# EasyEDA Pro project NeuraCore-Final.epro, board PCB1
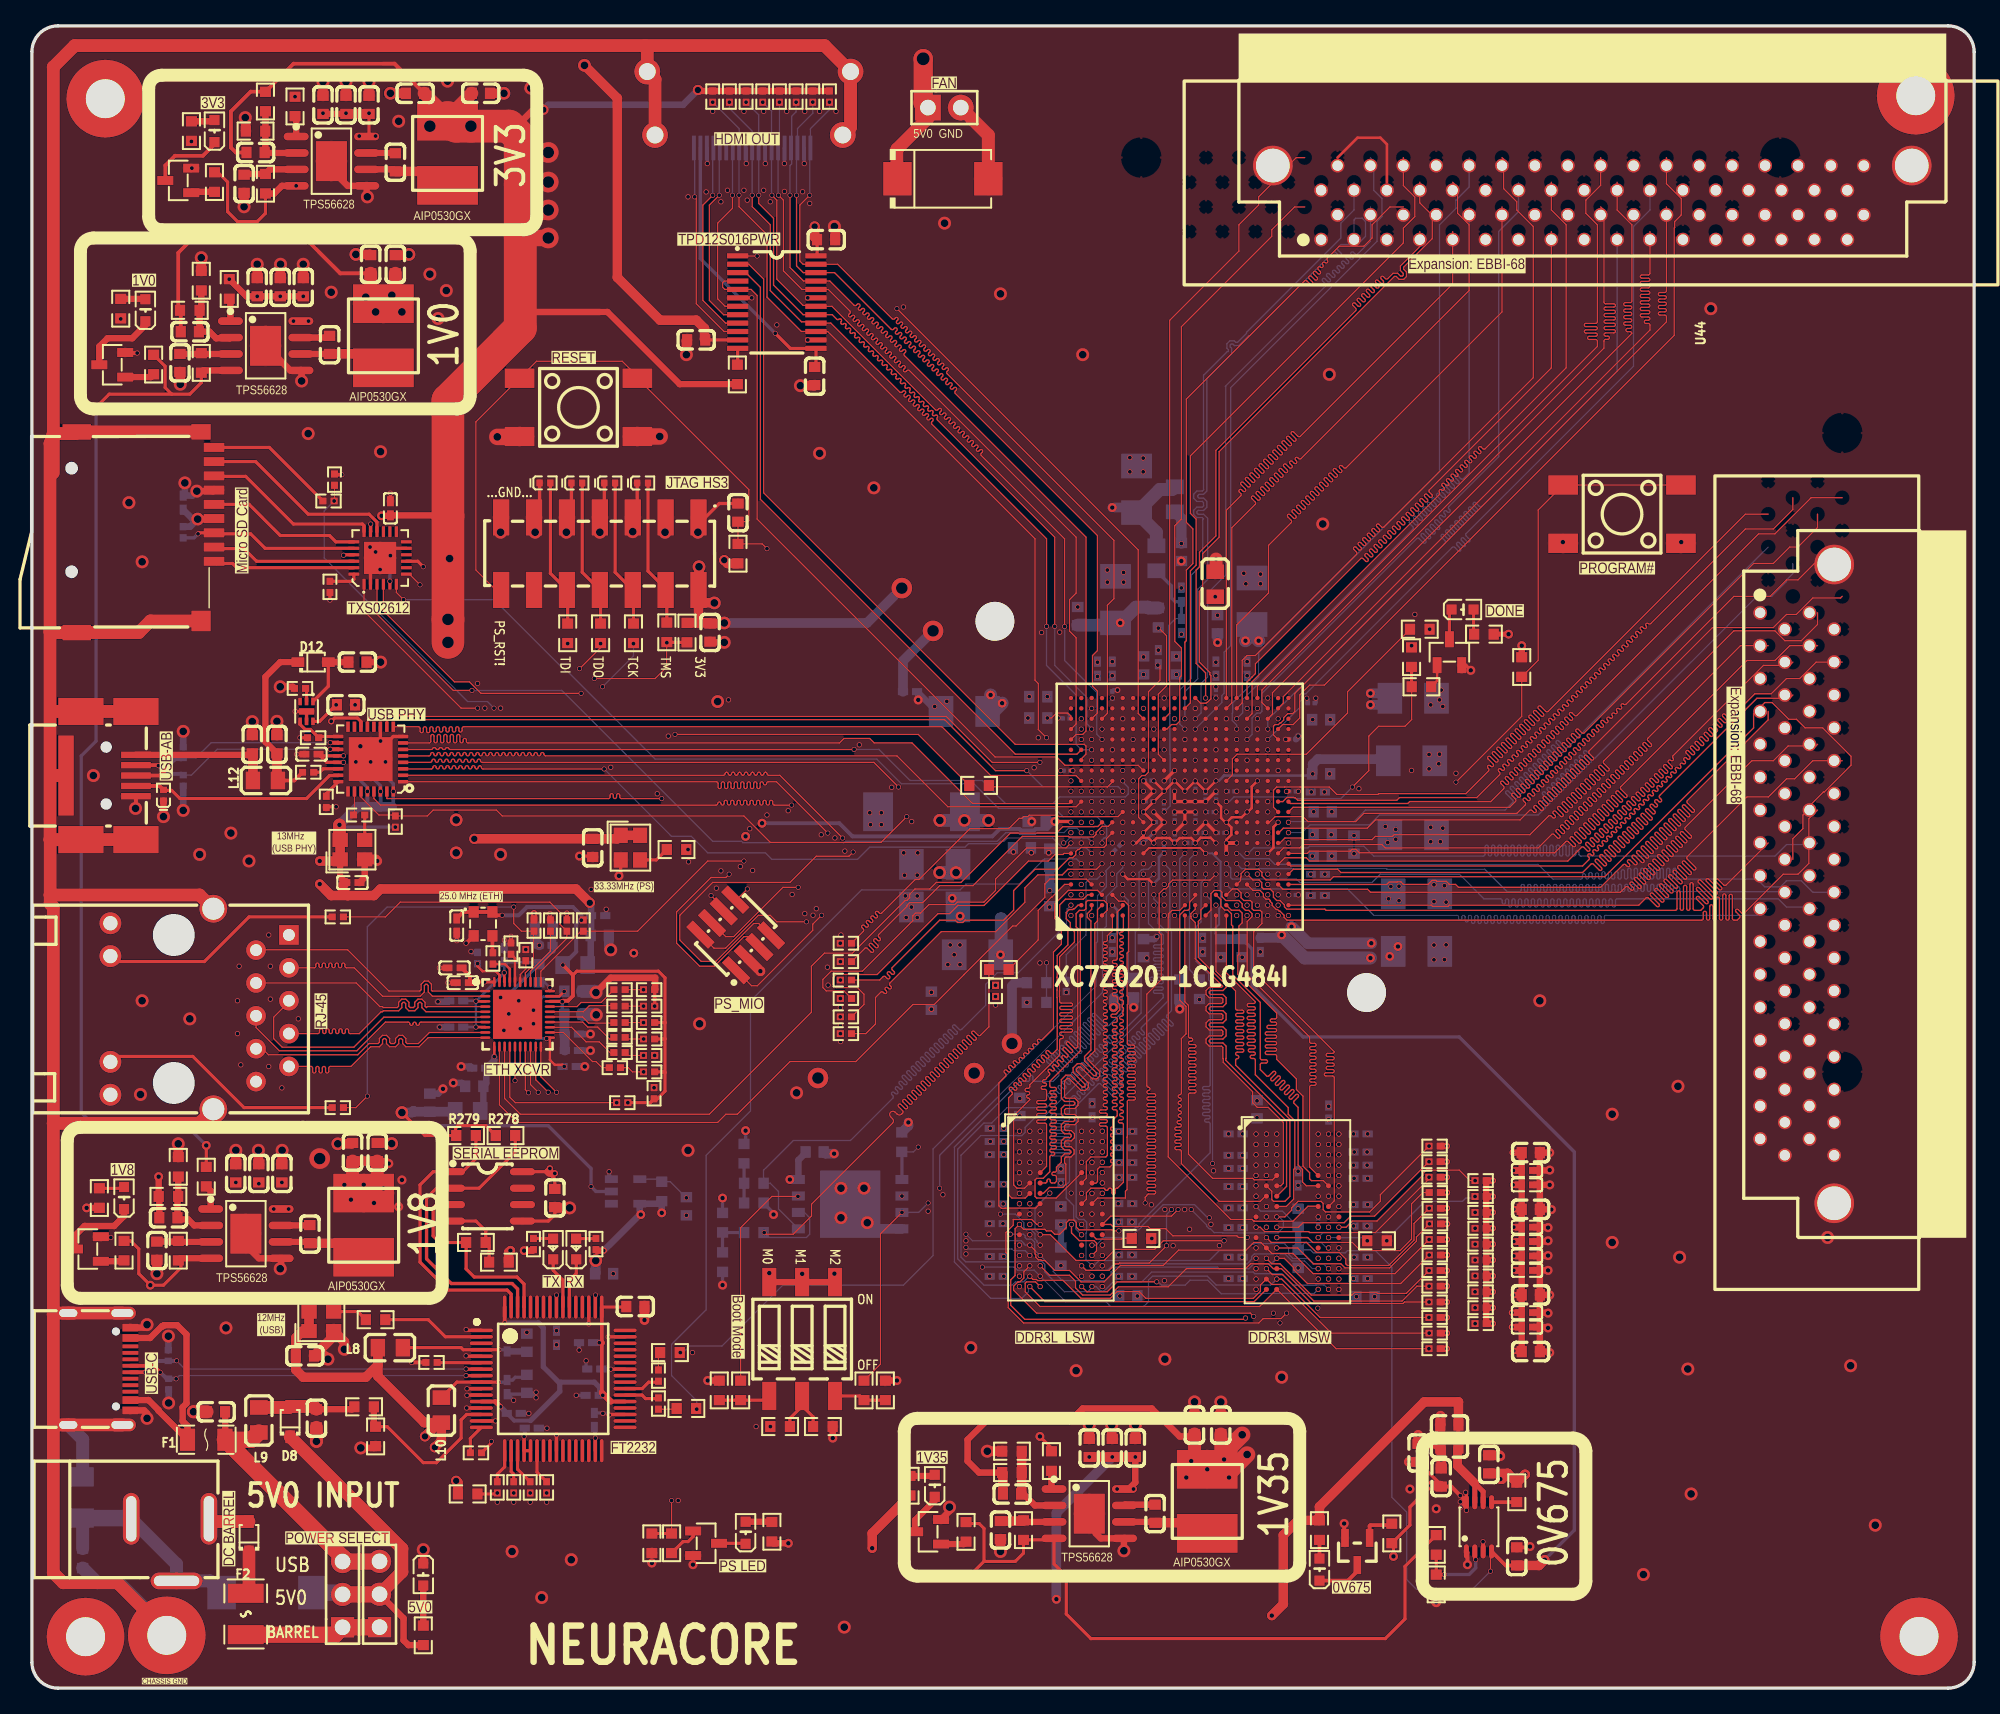
[diagram p13: board, top side]
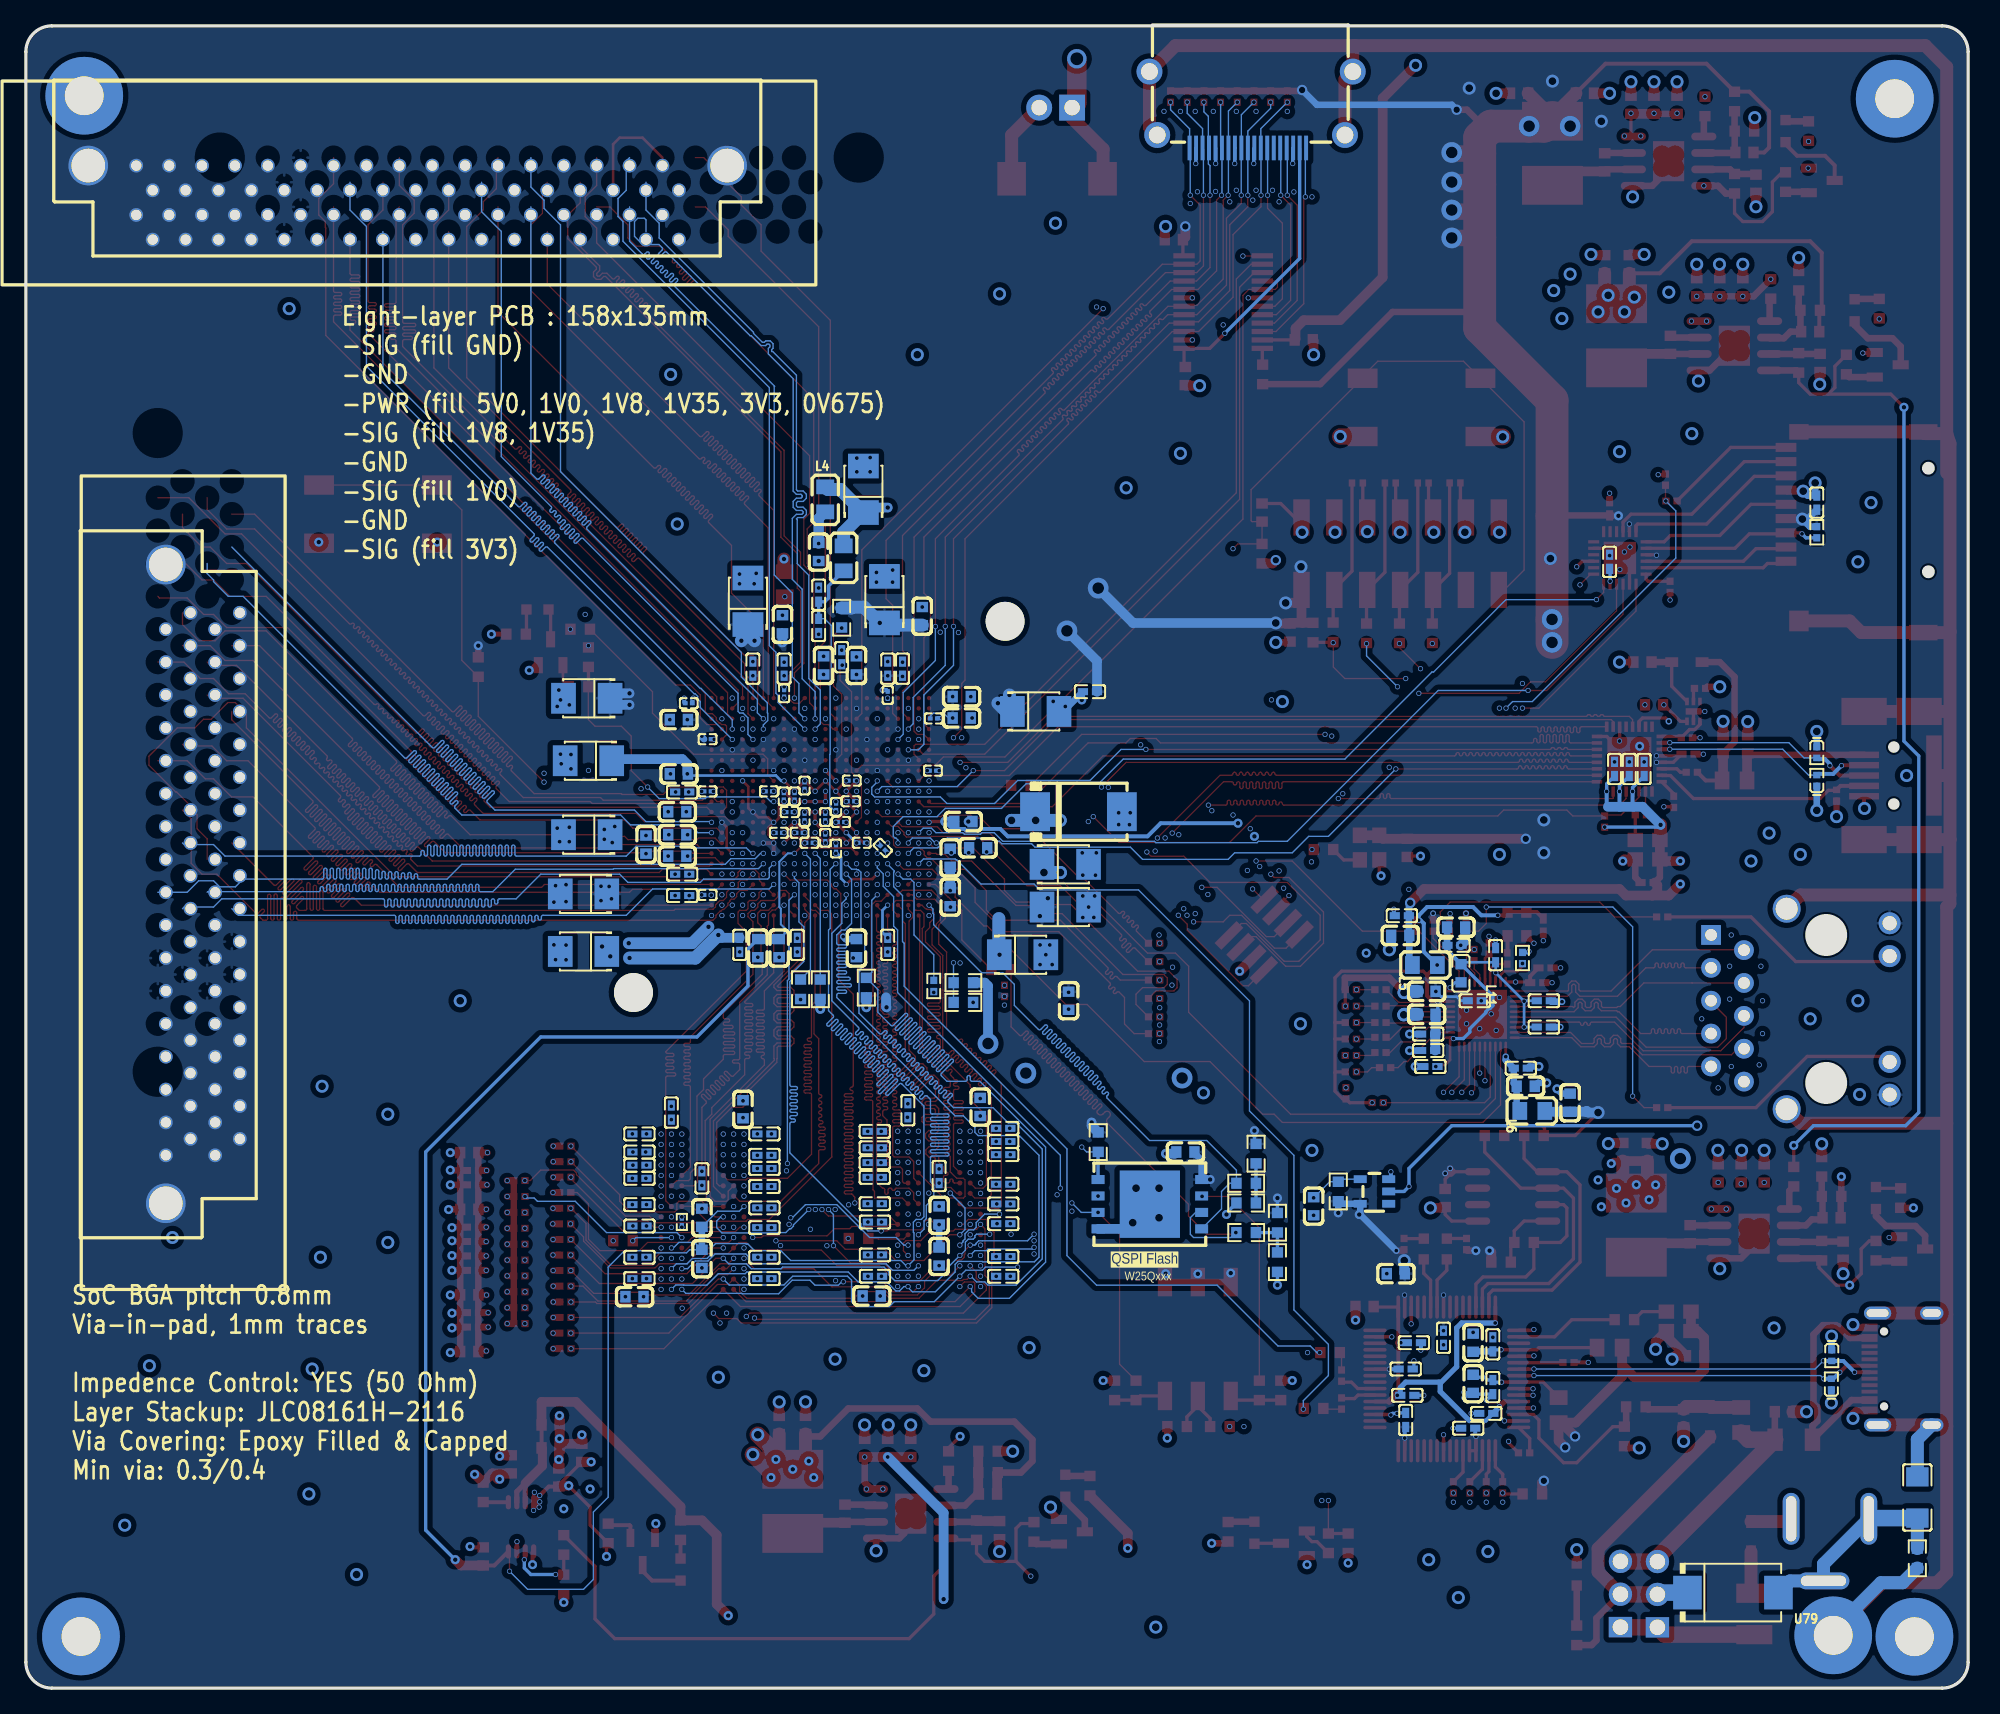
[diagram p14: board, bottom side, seen from below]

Outline 150 x 128.41 mm; copper layers: Top Layer, GND2, PWR3, SIGNAL4, GND5, SIGNAL6, GND7, Bottom Layer. Coordinates in mm from the lower left corner of the outline.
Outline path: 0,126.41 0,2 arc(0.59,0.59) 2,0 148,0 arc(149.41,0.59) 150,2 150,126.41 arc(149.41,127.82) 148,128.41 2,128.41 arc(0.59,127.82) 0,126.41
Stack: Top Layer 0.035mm 外层铜厚1oz / Dielectric1 0.1164mm 2116 RC54% 4.9mil / GND2 0.035mm - / Dielectric2 0.3mm 0.3mm H/HOZ 不含铜 / PWR3 0.035mm - / Dielectric3 0.0764mm 1080 RC67% 3.3mil / SIGNAL4 0.035mm - / Dielectric4 0.0764mm 1080 RC67% 3.3mil / GND5 0.035mm - / Dielectric5 0.3mm 0.3mm H/HOZ 不含铜 / SIGNAL6 0.035mm - / Dielectric6 0.0764mm 1080 RC67% 3.3mil / GND7 0.035mm - / Dielectric7 0.0764mm 1080 RC67% 3.3mil / Bottom Layer 0.035mm 外层铜厚1oz

## Design rules (mm)
net DP1: USB_D
net DN1: USB_D
net DDR_DQS1_P: DDR_DQS1
net DDR_DQS1_N: DDR_DQS1
net DDR_DQS0_N: DDR_DQS0
net DDR_DQS0_P: DDR_DQS0
net DDR_CK_P: DDR_CK
net DDR_CK_N: DDR_CK
net DDR_DQS2_P: DDR_DQS2
net DDR_DQS2_N: DDR_DQS2
net DDR_DQS3_N: DDR_DQS3
net DDR_DQS3_P: DDR_DQS3
net MDI0_P: MDI0
net MDI0_N: MDI0
net MDI1_P: MDI1
net MDI1_N: MDI1
net MDI2_P: MDI2
net MDI2_N: MDI2
net MDI3_P: MDI3
net MDI3_N: MDI3
net HDMI_TX_D2_P: HDMI_TX_D2
net HDMI_TX_D0_P: HDMI_TX_D0
net HDMI_TX_D2_N: HDMI_TX_D2
net HDMI_TX_D0_N: HDMI_TX_D0
net HDMI_TX_CLK_N: HDMI_TX_CLK
net HDMI_TX_CLK_P: HDMI_TX_CLK
net HDMI_TX_D1_N: HDMI_TX_D1
net HDMI_TX_D1_P: HDMI_TX_D1
net HDMI_RX_D0_N: HDMI_RX_D0
net HDMI_RX_D0_P: HDMI_RX_D0
net HDMI_RX_D2_N: HDMI_RX_D2
net HDMI_RX_D2_P: HDMI_RX_D2
net HDMI_RX_D1_N: HDMI_RX_D1
net HDMI_RX_D1_P: HDMI_RX_D1
net HDMI_RX_CLK_N: HDMI_RX_CLK
net HDMI_RX_CLK_P: HDMI_RX_CLK
net OTG_DN: OTG_DP
net OTG_DP: OTG_DP
template: Custom Config
spacing copperThickness1oz (default): track to track 0.089, other pairs 0.089 to 0.3
spacing copperThickness2oz: track to track 0.203, other pairs 0.152 to 0.3
spacing copperThicknessInner0.5oz: track to track 0.089, other pairs 0.152 to 0.3
track width copperThickness1oz (default): min 0.08, default 0.09, max 2.54
track width copperThickness2oz: min 0.203, default 0.254, max 2.54
track width copperThickness0.5oz: min 0.089, default 0.254, max 2.54
differential pair differentialPair (default): width min 0.099, default 0.254, max 2.54; gap min 0.099, default 0.152
via viaSize (default): diameter min 0.4, default 0.61, max 10; hole min 0.3, default 0.305, max 6.3
net QSPI_DQ1_M1 uses QSPI
net QSPI_DQ2_M2 uses QSPI
net QSPI_DQ0_M3 uses QSPI
net QSPI_CSB uses QSPI
net QSPI_CLK uses QSPI
net QSPI_DQ3_M0 uses QSPI
net DDR_ODT uses DDR_ACC
net DDR_DQ13 uses DDR_BL1
net DDR_DQ11 uses DDR_BL1
net DDR_DQ2 uses DDR_BL0
net DDR_DQ6 uses DDR_BL0
net DDR_CSB uses DDR_ACC
net DDR_BA0 uses DDR_ACC
net DDR_ADDR3 uses DDR_ACC
net DDR_ADDR5 uses DDR_ACC
net DDR_ADDR7 uses DDR_ACC
net DDR_RSTB uses DDR_ACC
net DDR_DQ15 uses DDR_BL1
net DDR_DQ9 uses DDR_BL1
net DDR_DM0 uses DDR_BL0
net DDR_DQ0 uses DDR_BL0
net DDR_DQS1_P uses DDR_BL1
net DDR_DQS1_N uses DDR_BL1
net DDR_DQ4 uses DDR_BL0
net DDR_RASB uses DDR_ACC
net DDR_CASB uses DDR_ACC
net DDR_WEB uses DDR_ACC
net DDR_BA1 uses DDR_ACC
net DDR_ADDR0 uses DDR_ACC
net DDR_ADDR2 uses DDR_ACC
net DDR_ADDR9 uses DDR_ACC
net DDR_ADDR13 uses DDR_ACC
net DDR_DQ12 uses DDR_BL1
net DDR_DQS0_N uses DDR_BL0
net DDR_DQS0_P uses DDR_BL0
net DDR_DQ8 uses DDR_BL1
net DDR_DM1 uses DDR_BL1
net DDR_DQ1 uses DDR_BL0
net DDR_DQ7 uses DDR_BL0
net DDR_CK_P uses DDR_ACC
net DDR_CK_N uses DDR_ACC
net DDR_ADDR10 uses DDR_ACC
net DDR_ADDR12 uses DDR_ACC
net DDR_ADDR1 uses DDR_ACC
net DDR_ADDR11 uses DDR_ACC
net DDR_ADDR14 uses DDR_ACC
net DDR_DQ14 uses DDR_BL1
net DDR_DQ10 uses DDR_BL1
net DDR_DQ3 uses DDR_BL0
net DDR_DQ5 uses DDR_BL0
net DDR_ADDR4 uses DDR_ACC
net DDR_ADDR6 uses DDR_ACC
net DDR_ADDR8 uses DDR_ACC
net DDR_CKE uses DDR_ACC
net DDR_DQ29 uses DDR_BL3
net DDR_DQ27 uses DDR_BL3
net DDR_DQ18 uses DDR_BL2
net DDR_DQ22 uses DDR_BL2
net DDR_DQ31 uses DDR_BL3
net DDR_DQ25 uses DDR_BL3
net DDR_DM3 uses DDR_BL3
net DDR_DQ16 uses DDR_BL2
net DDR_DQS2_P uses DDR_BL2
net DDR_DQS2_N uses DDR_BL2
net DDR_DQ20 uses DDR_BL2
net DDR_DQ28 uses DDR_BL3
net DDR_DQS3_N uses DDR_BL3
net DDR_DQS3_P uses DDR_BL3
net DDR_DQ24 uses DDR_BL3
net DDR_DM2 uses DDR_BL2
net DDR_DQ17 uses DDR_BL2
net DDR_DQ23 uses DDR_BL2
net DDR_DQ30 uses DDR_BL3
net DDR_DQ26 uses DDR_BL3
net DDR_DQ19 uses DDR_BL2
net DDR_DQ21 uses DDR_BL2
net DDR_BA2 uses DDR_ACC
net ETH_PHY_TXCLK uses ETH_PHY_TX
net ETH_PHY_TXCTL uses ETH_PHY_TX
net ETH_PHY_TXD0 uses ETH_PHY_TX
net ETH_PHY_TXD1 uses ETH_PHY_TX
net ETH_PHY_TXD2 uses ETH_PHY_TX
net ETH_PHY_TXD3 uses ETH_PHY_TX
net ETH_RXD2 uses ETH_RX
net ETH_TXCTL uses ETH_TX
net ETH_RXD0 uses ETH_RX
net ETH_TXD2 uses ETH_TX
net ETH_TXD0 uses ETH_TX
net ETH_RXCTL uses ETH_RX
net ETH_TXCLK uses ETH_TX
net ETH_RXD1 uses ETH_RX
net ETH_RXCLK uses ETH_RX
net ETH_RXD3 uses ETH_RX
net ETH_TXD3 uses ETH_TX
net ETH_TXD1 uses ETH_TX
net MDI0_P uses MDI
net MDI0_N uses MDI
net MDI1_P uses MDI
net MDI1_N uses MDI
net MDI2_P uses MDI
net MDI2_N uses MDI
net MDI3_P uses MDI
net MDI3_N uses MDI
net USB_DIR uses USB_DATA
net USB_STP uses USB_DATA
net USB_DATA7 uses USB_DATA
net USB_DATA6 uses USB_DATA
net USB_DATA5 uses USB_DATA
net USB_DATA4 uses USB_DATA
net USB_DATA3 uses USB_DATA
net USB_DATA2 uses USB_DATA
net USB_DATA1 uses USB_DATA
net USB_DATA0 uses USB_DATA
net USB_NXT uses USB_DATA
net USB_CLK uses USB_DATA
net HDMI_TX_D2_P uses HDMI_TX
net HDMI_TX_D0_P uses HDMI_TX
net HDMI_TX_D2_N uses HDMI_TX
net HDMI_TX_D0_N uses HDMI_TX
net HDMI_TX_CLK_N uses HDMI_TX
net HDMI_TX_CLK_P uses HDMI_TX
net HDMI_TX_D1_N uses HDMI_TX
net HDMI_TX_D1_P uses HDMI_TX
net IO_L12N_T1_SRCC_13 uses IOL_RIGHT
net IO_L7N_T1_13 uses IOL_RIGHT
net IO_L8N_T1_13 uses IOL_RIGHT
net IO_L9P_T1_DQS_13 uses IOL_RIGHT
net IO_L9N_T1_DQS_13 uses IOL_RIGHT
net IO_L7P_T1_13 uses IOL_RIGHT
net IO_L8P_T1_13 uses IOL_RIGHT
net IO_L11P_T1_SRCC_13 uses IOL_RIGHT
net IO_L11N_T1_SRCC_13 uses IOL_RIGHT
net IO_L10P_T1_13 uses IOL_RIGHT
net IO_L10N_T1_13 uses IOL_RIGHT
net IO_L12P_T1_SRCC_13 uses IOL_RIGHT
net IO_L14P_T2_SRCC_13 uses IOL_RIGHT
net IO_L14N_T2_SRCC_13 uses IOL_RIGHT
net IO_L16P_T2_13 uses IOL_RIGHT
net IO_L16N_T2_13 uses IOL_RIGHT
net IO_L18N_T2_13 uses IOL_RIGHT
net IO_L15N_T2_DQS_13 uses IOL_RIGHT
net IO_L17P_T2_13 uses IOL_RIGHT
net IO_L17N_T2_13 uses IOL_RIGHT
net IO_L13P_T2_MRCC_13 uses IOL_RIGHT
net IO_L13N_T2_MRCC_13 uses IOL_RIGHT
net IO_L15P_T2_DQS_13 uses IOL_RIGHT
net IO_L18P_T2_13 uses IOL_RIGHT
net IO_L19N_T3_VREF_13 uses IOL_RIGHT
net IO_25_13 uses IOL_RIGHT
net IO_L22N_T3_13 uses IOL_RIGHT
net IO_L23P_T3_13 uses IOL_RIGHT
net IO_L21N_T3_DQS_13 uses IOL_RIGHT
net IO_L24P_T3_13 uses IOL_RIGHT
net IO_L19P_T3_13 uses IOL_RIGHT
net IO_L20P_T3_13 uses IOL_RIGHT
net IO_L22P_T3_13 uses IOL_RIGHT
net IO_L20N_T3_13 uses IOL_RIGHT
net IO_L21P_T3_DQS_13 uses IOL_RIGHT
net IO_L23N_T3_13 uses IOL_RIGHT
net IO_L24N_T3_13 uses IOL_RIGHT
net IO_L2P_T0_33 uses IOL_TOP
net IO_L5P_T0_33 uses IOL_TOP
net IO_L2N_T0_33 uses IOL_TOP
net IO_L6N_T0_VREF_33 uses IOL_TOP
net IO_L3P_T0_DQS_33 uses IOL_TOP
net IO_L4N_T0_33 uses IOL_TOP
net IO_L1P_T0_33 uses IOL_TOP
net IO_L1N_T0_33 uses IOL_TOP
net IO_L6P_T0_33 uses IOL_TOP
net IO_L5N_T0_33 uses IOL_TOP
net IO_L4P_T0_33 uses IOL_TOP
net IO_L3N_T0_DQS_33 uses IOL_TOP
net HDMI_RX_D0_N uses HDMI_RX
net HDMI_RX_D0_P uses HDMI_RX
net HDMI_RX_D2_N uses HDMI_RX
net HDMI_RX_D2_P uses HDMI_RX
net HDMI_RX_D1_N uses HDMI_RX
net HDMI_RX_D1_P uses HDMI_RX
net HDMI_RX_CLK_N uses HDMI_RX
net HDMI_RX_CLK_P uses HDMI_RX
net IO_L9N_T1_33 uses IOL_TOP
net IO_L11P_T1_SRCC_33 uses IOL_TOP
net IO_L8P_T1_33 uses IOL_TOP
net IO_L12N_T1_MRCC_33 uses IOL_TOP
net IO_L9P_T1_33 uses IOL_TOP
net IO_L12P_T1_MRCC_33 uses IOL_TOP
net IO_L11N_T1_SRCC_33 uses IOL_TOP
net ETH_PHY_RXD3 uses ETH_PHY_RX
net ETH_PHY_RXD2 uses ETH_PHY_RX
net ETH_PHY_RXD1 uses ETH_PHY_RX
net ETH_PHY_RXD0 uses ETH_PHY_RX
net ETH_PHY_RXCTL uses ETH_PHY_RX
net ETH_PHY_RXCLK uses ETH_PHY_RX
eq len grp QSPI uses QSPI
eq len grp DDR_ACC uses DDR_ACC
eq len grp DDR_BL1 uses DDR_BL1
eq len grp DDR_BL0 uses DDR_BL0
eq len grp DDR_BL3 uses DDR_BL3
eq len grp DDR_BL2 uses DDR_BL2
eq len grp ETH_PHY_TX uses ETH_PHY_TX
eq len grp ETH_RX uses ETH_RX
eq len grp ETH_TX uses ETH_TX
eq len grp MDI uses MDI
eq len grp USB_DATA uses USB_DATA
eq len grp HDMI_TX uses HDMI_TX
eq len grp IOL_RIGHT uses IOL_RIGHT
eq len grp IOL_TOP uses IOL_TOP
eq len grp HDMI_RX uses HDMI_RX
eq len grp ETH_PHY_RX uses ETH_PHY_RX
pour e16650 uses copperRegionSafer
pour e17316 uses copperRegionSafer
pour e10447 uses copperRegionSafer
pour e18637 uses copperRegionSafer
pour e22974 uses copperRegion

## Placement (name value [footprint] x y rotation side)
C1  10uF  [C0603]  22.48 122.31 90 top
C2  10uF  [C0603]  24.26 122.31 90 top
C3  0.1uF  [C0603]  26.03 122.31 90 top
C4  10pF  [C0603]  17.27 118.63 180 top
C5  10pF  [C0603]  16.38 116.22 270 top
C6  47nF  [C0603]  79.47 36.51 270 bottom
C7  0.1uF  [C0603]  28.07 117.87 270 top
C8  22uF  [C0603]  34.67 123.2 0 top
C9  22uF  [C0603]  29.59 123.2 180 top
C10  10uF  [C0603]  15.75 39.76 90 top
C11  10uF  [C0603]  17.53 39.76 90 top
C12  0.1uF  [C0603]  19.3 39.76 90 top
C13  10pF  [C0603]  10.54 36.34 180 top
C14  10pF  [C0603]  9.65 33.8 270 top
C15  0.1uF  [C0603]  21.46 35.06 270 top
C16  22uF  [C0603]  26.67 41.42 90 top
C17  22uF  [C0603]  24.77 41.42 90 top
C18  10uF  [C0603]  81.66 18.56 90 top
C19  10uF  [C0603]  83.44 18.56 90 top
C20  0.1uF  [C0603]  85.22 18.56 90 top
C21  47pF  [C0603]  75.69 15 180 top
C22  10pF  [C0603]  74.8 12.21 270 top
C23  0.1uF  [C0603]  86.74 13.48 270 top
C24  22uF  [C0603]  89.79 20.33 90 top
C25  22uF  [C0603]  91.82 20.33 90 top
C26  10uF  [C0603]  17.4 108.22 90 top
C27  10uF  [C0603]  19.18 108.22 90 top
C28  0.1uF  [C0603]  20.95 108.22 90 top
C29  150pF  [C0603]  12.19 104.79 180 top
C30  10pF  [C0603]  11.43 102.38 270 top
C31  0.1uF  [C0603]  22.99 103.77 270 top
C32  22uF  [C0603]  28.07 110 90 top
C33  22uF  [C0603]  26.16 110 90 top
C34  4.7uF  [C0603]  38.23 23.51 270 bottom
C35  47nF  [C0603]  97.79 36.34 270 bottom
C36  47nF  [C0603]  79.47 33.34 270 bottom
C37  47nF  [C0603]  97.79 33.16 270 bottom
C38  47nF  [C0603]  91.82 57.16 270 bottom
C39  47nF  [C0603]  93.47 57.16 270 bottom
C40  47nF  [C0402]  115.47 39.99 0 top
C41  47nF  [C0402]  115.47 27.89 0 top
C42  4.7uF  [C0603]  78.61 61.1 270 bottom
C43  47nF  [C0402]  115.47 35.61 0 top
C44  47nF  [C0402]  115.47 32.27 0 top
C45  4.7uF  [C0603]  77.72 74.94 180 bottom
C46  4.7uF  [C0603]  103 30.24 0 bottom
C47  470nF  [C0402]  102.62 31.64 0 bottom
C48  47nF  [C0402]  102.62 37.35 0 bottom
C49  4.7uF  [C0603]  77.72 76.59 180 bottom
C50  47nF  [C0402]  92.96 37.1 180 bottom
C51  47nF  [C0402]  92.96 35.57 180 bottom
C52  4.7uF  [C0603]  78.61 64.15 90 bottom
C53  47nF  [C0402]  92.96 40.15 180 bottom
C54  47nF  [C0402]  92.96 42.81 180 bottom
C55  4.7uF  [C0603]  80.77 82.82 90 bottom
C56  47nF  [C0402]  92.96 33.29 180 bottom
C57  47nF  [C0402]  102.62 33.29 0 bottom
C58  4.7uF  [C0603]  91.57 82.18 90 bottom
C59  47nF  [C0402]  102.62 40.4 0 bottom
C60  4.7uF  [C0603]  94.62 44.72 90 bottom
C61  470nF  [C0402]  100.15 44.46 90 bottom
C62  4.7uF  [C0603]  99.57 74.82 0 bottom
C63  47nF  [C0402]  92.96 31.64 180 bottom
C64  47nF  [C0402]  102.62 35.7 0 bottom
C65  4.7uF  [C0603]  85.85 79.01 90 bottom
C66  47nF  [C0402]  102.62 39.38 0 bottom
C67  47nF  [C0402]  102.62 41.42 0 bottom
C68  47nF  [C0402]  92.96 41.16 180 bottom
C69  47nF  [C0402]  92.96 38.75 180 bottom
C70  47nF  [C0402]  102.62 42.81 0 bottom
C71  47nF  [C0402]  97.79 39.38 90 bottom
C72  470nF  [C0402]  115.47 34.5 0 top
C73  4.7uF  [C0603]  76.45 64.91 180 bottom
C74  470nF  [C0402]  115.47 29 0 top
C75  470nF  [C0402]  115.47 33.38 0 top
C76  470nF  [C0402]  115.47 38.88 0 top
C77  4.7uF  [C0603]  84.68 30.29 0 bottom
C78  4.7uF  [C0603]  99.69 67.7 0 bottom
C79  470nF  [C0402]  81.88 44.64 90 bottom
C80  47nF  [C0402]  84.44 41.74 0 bottom
C81  47nF  [C0402]  84.44 40.6 0 bottom
C82  47nF  [C0402]  74.52 31.81 180 bottom
C83  4.7uF  [C0603]  88.39 79.01 90 bottom
C84  47nF  [C0402]  84.42 36.01 0 bottom
C85  4.7uF  [C0603]  99.69 65.93 0 bottom
C86  47nF  [C0402]  84.44 37.42 0 bottom
C87  47nF  [C0402]  84.44 43.01 0 bottom
C88  47nF  [C0402]  74.52 37.4 180 bottom
C89  47nF  [C0402]  84.44 39.45 0 bottom
C90  4.7uF  [C0603]  115.76 26 0 top
C91  4.7uF  [C0603]  115.76 30.38 0 top
C92  4.7uF  [C0603]  115.76 36.99 0 top
C93  4.7uF  [C0603]  115.76 41.37 0 top
C94  4.7uF  [C0603]  76.29 44.9 90 bottom
C95  470nF  [C0402]  84.42 31.81 0 bottom
C96  47nF  [C0402]  74.52 41.21 180 bottom
C97  47nF  [C0402]  74.52 38.93 180 bottom
C98  47nF  [C0402]  74.52 33.34 180 bottom
C99  47nF  [C0402]  74.52 42.23 180 bottom
C100  47nF  [C0402]  74.52 35.88 180 bottom
C101  47nF  [C0402]  74.52 43.24 180 bottom
C102  47nF  [C0402]  84.42 33.47 0 bottom
C103  47nF  [C0402]  79.47 39.56 90 bottom
C144  100nF  [C0603]  60.45 41.42 0 bottom
C155  4u7  [C0603]  41.83 52.05 0 bottom
C157  4u7  [C0603]  43.86 58.15 0 bottom
C159  4u7  [C0603]  41.83 53.83 0 bottom
C166  4u7  [C0603]  34.16 46.5 180 bottom
C168  4u7  [C0603]  30.73 45.23 90 bottom
C170  4u7  [C0603]  39.54 58.78 180 bottom
C176  100nF  [C0603]  52.37 81.54 270 top
C181  4.7uF  [C0603]  14.22 21.35 180 top
C182  4.7uF  [C0603]  21.97 20.84 270 top
C183  100nF  [C0603]  44.2 32.02 0 bottom
C184  4.7uF  [C0603]  46.61 29.48 0 top
C189  4.7uF  [C0603]  38.23 26.68 90 bottom
C190  100nF  [C0603]  40.39 37.86 270 top
C191  100nF  [C0603]  21.08 25.67 0 top
C192  100nF  [C0603]  43.31 64.91 270 top
C193  100nF  [C0603]  69.47 53.1 270 bottom
C194  100nF  [C0603]  50.55 37.22 270 bottom
C195  100nF  [C0603]  54.53 90.81 90 top
C217  22uF  [C0603]  109.47 20.33 180 top
C218  4.7uF  [C0603]  112.52 17.28 90 top
C219  4.7uF  [C0603]  109.47 18.56 180 top
C220  22uF  [C0603]  108.84 16.27 90 top
C221  4.7uF  [C0603]  107.06 18.17 90 top
C222  4.7uF  [C0603]  114.68 10.17 90 top
C227  4.7uF  [C0603]  18.92 72.91 90 top
C228  4.7uF  [C0603]  17.02 72.91 90 top
C229  4.7uF  [C0603]  24.26 75.96 0 top
C230  4.7uF  [C0603]  25.15 79.26 0 top
C240  100nF  [C0603]  51.31 104.15 0 top
C241  100nF  [C0603]  61.34 111.9 180 top
C243  100nF  [C0603]  60.45 101.36 90 top
C244  4.7uF  [C0603]  99.57 70.63 0 bottom
C248  330uF  [CAP-SMD_L7.3-W4.3-L-FD]  68.71 67.7 180 bottom
C253  100uF  [CAP-SMD_L3.5-W2.8-FD]  106.55 71.64 0 bottom
C257  100uF  [CAP-SMD_L3.5-W2.8-FD]  94.23 83.96 90 bottom
C258  100uF  [CAP-SMD_L3.5-W2.8-FD]  85.32 92.61 90 bottom
C259  470nF  [C0402]  93.85 78.75 90 bottom
C261  47uF  [CAP-SMD_L3.5-W2.8-FD]  106.68 76.47 0 bottom
C262  100uF  [CAP-SMD_L3.5-W2.8-FD]  69.72 60.34 180 bottom
C263  100uF  [CAP-SMD_L3.5-W2.8-FD]  83.69 84.09 90 bottom
C264  470nF  [C0402]  82.3 78.75 90 bottom
C265  470nF  [C0402]  83.44 78.75 90 bottom
C268  470nF  [C0402]  99.31 61.23 0 bottom
C274  47uF  [CAP-SMD_L3.5-W2.8-FD]  73.03 56.66 180 bottom
C277  4.7uF  [C0603]  102.11 65.16 270 bottom
C278  4.7uF  [C0603]  77.6 66.94 180 bottom
C279  4.7uF  [C0603]  99.69 64.28 0 bottom
C280  4.7uF  [C0603]  85.85 57.16 270 bottom
C284  470nF  [C0402]  94.87 57.42 270 bottom
C285  470nF  [C0402]  83.44 57.42 270 bottom
C286  470nF  [C0402]  90.42 57.42 270 bottom
C287  100uF  [CAP-SMD_L3.5-W2.8-FD]  106.68 65.93 0 bottom
C288  100uF  [CAP-SMD_L3.5-W2.8-FD]  106.93 56.91 0 bottom
C289  100uF  [CAP-SMD_L3.5-W2.8-FD]  69.72 63.64 180 bottom
C290  100uF  [CAP-SMD_L3.5-W2.8-FD]  106.93 61.35 0 bottom
C291  100uF  [CAP-SMD_L3.5-W2.8-FD]  72.01 75.45 180 bottom
C293  470nF  [C0402]  91.44 78.75 90 bottom
C294  470nF  [C0402]  99.31 69.23 0 bottom
C295  470nF  [C0402]  99.31 62.88 0 bottom
C300  4.7uF  [C0603]  88.77 87.77 90 bottom
C301  470nF  [C0402]  87 79.64 90 bottom
C302  470nF  [C0402]  88.77 82.06 270 bottom
C303  100nF  [C0402]  88.77 84.47 90 bottom
C348  1nF 250V  [C1206]  3.92 14.73 270 bottom
C349  100nF  [C0402]  36.7 23.25 270 bottom
C350  100nF  [C0402]  36.7 26.56 90 bottom
C351  100nF  [C0402]  37.21 21.22 0 bottom
C352  100nF  [C0402]  43.31 22.62 180 bottom
C353  100nF  [C0402]  42.8 26.68 180 bottom
C354  100nF  [C0402]  43.43 24.65 180 bottom
C355  100nF  [C0402]  43.43 20.71 90 bottom
C356  100nF  [C0402]  38.61 20.08 0 bottom
C357  100nF  [C0402]  40.51 27.06 270 bottom
C358  100nF  [C0402]  27.69 87.01 270 bottom
C359  470nF  [C0402]  27.69 91.14 90 top
C360  470nF  [C0402]  11.68 91.58 90 bottom
C361  100nF  [C0402]  26.16 71.01 90 bottom
C362  100nF  [C0402]  27.3 71.01 90 bottom
C363  100nF  [C0402]  25.02 71.01 90 bottom
C364  100nF  [C0402]  21.59 72.15 180 top
C365  100nF  [C0402]  24.75 62.23 0 top
C366  100nF  [C0402]  32.77 51.07 180 bottom
C367  100nF  [C0402]  32.77 53.1 180 bottom
C368  100nF  [C0402]  36.49 56.62 90 bottom
C369  100nF  [C0402]  32.81 58.91 270 top
C370  100nF  [C0402]  38.1 53.1 180 bottom
C371  100nF  [C0402]  41.7 50.53 0 bottom
C372  100nF  [C0402]  43.73 59.67 0 bottom
C373  100nF  [C0402]  41.7 49.26 0 bottom
C374  100nF  [C0402]  41.53 48.02 0 bottom
C375  100nF  [C0402]  33.27 54.5 180 top
C376  100nF  [C0402]  32.64 55.64 180 top
C377  100nF  [C0402]  34.54 47.89 180 bottom
C378  100nF  [C0402]  67.82 76.98 0 bottom
C379  100nF  [C0402]  39.67 57.38 180 bottom
C380  470nF  [C0201]  90.63 68.89 270 bottom
C381  470nF  [C0201]  88.26 65.69 90 bottom
C382  470nF  [C0201]  89.48 65.31 180 bottom
C383  470nF  [C0201]  87.05 66.91 0 bottom
C384  470nF  [C0201]  91.02 67.68 0 bottom
C385  470nF  [C0201]  88.26 67.29 90 bottom
C386  470nF  [C0201]  91.46 68.89 90 bottom
C387  470nF  [C0201]  92.62 69.28 0 bottom
C388  470nF  [C0201]  98.81 76.09 0 bottom
C389  470nF  [C0201]  89.86 67.29 90 bottom
C390  470nF  [C0201]  90.25 66.08 180 bottom
C391  470nF  [C0201]  91.85 66.08 180 bottom
C392  470nF  [C0201]  86.28 68.51 180 bottom
C393  470nF  [C0201]  89.86 69.72 270 bottom
C394  470nF  [C0201]  97.35 69.28 0 bottom
C395  470nF  [C0201]  83.44 76.72 90 bottom
C396  470nF  [C0201]  97.35 61.28 0 bottom
C397  470nF  [C0201]  91.44 76.85 90 bottom
C398  470nF  [C0201]  79.88 74.91 180 bottom
C399  470nF  [C0201]  79.94 70.88 0 bottom
C400  470nF  [C0201]  85.45 65.31 0 bottom
C401  470nF  [C0201]  97.35 73.31 180 bottom
C402  470nF  [C0201]  86.22 70.11 180 bottom
C403  470nF  [C0201]  87.43 64.86 90 bottom
C404  470nF  [C0201]  87.42 68.09 90 bottom
C406  100nF  [C0201]  83.82 64.91 225 bottom
CARD2  TF-01A  [TF-SMD_TF-02]  8.76 89.29 270 top
CN2  10029449-111RLF  [HDMI-SMD_10029449-001RLF]  55.37 121.93 0 bottom
D1  -  [D0402]  39.62 93.1 0 top
D2  -  [D0402]  42.08 93.1 0 top
D3  -  [D0402]  44.62 93.1 0 top
D4  -  [D0402]  47.16 93.1 0 top
D6  -  [D0402]  10.56 23.49 90 bottom
D7  -  [D0402]  10.53 25.69 270 bottom
D8  PMEG1030EJ,115  [SOD-323_L1.8-W1.3-LS2.5-RD]  19.94 20.59 90 top
D9  -  [D0402]  10.16 68.97 90 top
D10  -  [D0402]  11.68 72.28 270 bottom
D11  -  [D0402]  11.68 70.12 90 bottom
D12  PMEG1030EJ,115  [SOD-323_L1.8-W1.3-LS2.5-RD]  21.72 79.26 0 top
D13  PMEG1030EJ,115  [SOD-323_L1.8-W1.3-LS2.5-RD]  16.76 11.7 90 top
DC1  -  [DC-IN-TH_DC-5520-1]  10.67 10.68 0 top
F1  1206L050/15YR  [F1206]  13.46 19.19 0 top
F2  -  [F1210]  16.51 5.73 270 top
H2  HDR  [HDR-TH_3P-P2.54-V-M-1]  26.85 7.25 90 top
H3  HDR  [HDR-TH_3P-P2.54-V-M-1]  23.99 7.24 90 top
H4  HDR  [HDR-TH_2P-P2.54-V-M]  70.47 122.1 0 top
H5  PZ127-2-04-S  [HDR-SMD_8P-P1.27-V-M-C2-C4-LS5.3]  54.36 58.18 45 top
HDR1  Digilent JTAG-HS3  [HDR-SMD_14P-P2.54-V-M-R2-C7-LS7.4]  43.86 87.64 180 top
L2  MH2029-600Y  [L0805]  86.84 87.28 270 bottom
L3  MH2029-600Y  [L0805]  91.39 85.28 270 top
L4  MH2029-600Y  [L0805]  88.26 91.83 90 bottom
L5  MH2029-600Y  [L0805]  41.95 55.86 0 bottom
L6  MH2029-600Y  [L0805]  33.66 44.59 180 bottom
L8  MH2029-600Y  [L0805]  27.69 26.3 0 top
L9  MH2029-600Y  [L0805]  17.53 20.71 90 top
L10  MH2029-600Y  [L0805]  31.62 21.48 90 top
L11  3.3uH  [L0603]  39.16 55.23 90 bottom
L12  MH2029-600Y  [L0805]  18.03 70.12 180 top
LED9  -  [LED0603-R-RD]  69.72 15.63 90 top
LED10  -  [LED0603-R-RD]  30.23 8.78 270 top
LED11  -  [LED0603-R-RD]  8.76 106.44 90 top
LED12  -  [LED0603-R-RD]  7.11 37.86 90 top
LED14  -  [LED0603-R-RD]  110.49 83.33 0 top
LED15  -  [LED0603-RD_GREEN]  42.04 33.92 90 top
LED16  -  [LED0603-RD_GREEN]  40.26 33.92 90 top
LED17  -  [LED0603-R-RD]  55.12 12.01 90 top
LED18  -  [LED0603-R-RD]  99.44 9.16 90 top
LED19  -  [LED0603-R-RD]  14.1 120.28 90 top
Q1  T2N7002AK,LM  [SOT-23-3_L2.9-W1.3-P1.90-LS2.4-BR]  6.21 102.23 0 top
Q2  T2N7002AK,LM  [SOT-23-3_L2.9-W1.3-P1.90-LS2.4-BR]  69.22 12.08 0 top
Q3  T2N7002AK,LM  [SOT-23-3_L2.9-W1.3-P1.90-LS2.4-BR]  4.32 33.92 0 top
Q5  T2N7002AK,LM  [SOT-23-3_L2.9-W1.3-P1.90-LS2.4-BR]  11.3 116.47 0 top
Q6  T2N7002AK,LM  [SOT-23-3_L2.9-W1.3-P1.90-LS2.4-BR]  109.47 80.02 270 top
Q7  T2N7002AK,LM  [SOT-23-3_L2.9-W1.3-P1.90-LS2.4-BR]  52.07 11.19 180 top
Q8  BSH103,215  [TO-236AB_L2.9-W1.3-P0.95-LS2.3-BR]  102.36 10.55 90 top
R1  73.2K  [R0603]  18.03 122.57 90 top
R2  22.1K  [R0603]  17.27 120.28 180 top
R3  10K  [R0603]  20.32 122.19 90 top
R4  100K  [R0603]  18.03 116.22 270 top
R5  10K  [R0603]  13.46 39.51 90 top
R6  30.1K  [R0603]  10.54 37.99 180 top
R7  22.1K  [R0603]  11.3 40.27 90 top
R8  100K  [R0603]  11.3 33.8 270 top
R9  10K  [R0603]  78.74 17.54 90 top
R10  17.4K  [R0603]  75.69 16.65 180 top
R11  22.1K  [R0603]  75.69 18.3 180 top
R12  100K  [R0603]  76.58 12.21 270 top
R13  10K  [R0603]  15.24 108.09 90 top
R14  6.81K  [R0603]  12.19 106.44 180 top
R15  22.1K  [R0603]  13.08 108.73 90 top
R16  100K  [R0603]  13.08 102.38 270 top
R18  49.9  [R0402]  111.89 39.21 0 top
R19  49.9  [R0402]  108.35 38.28 0 top
R20  49.9  [R0402]  108.33 40.67 0 top
R21  49.9  [R0402]  108.33 41.87 0 top
R22  49.9  [R0402]  108.35 37.07 0 top
R23  49.9  [R0402]  108.36 35.86 0 top
R24  49.9  [R0402]  111.89 35.52 0 top
R25  49.9  [R0402]  108.34 34.66 0 top
R26  49.9  [R0402]  108.33 31.05 0 top
R27  49.9  [R0402]  111.89 34.3 0 top
R28  49.9  [R0402]  108.35 33.46 0 top
R29  49.9  [R0402]  108.33 29.83 0 top
R30  49.9  [R0402]  111.89 33.07 0 top
R31  49.9  [R0402]  108.33 32.26 0 top
R32  49.9  [R0402]  111.89 28.16 0 top
R33  49.9  [R0402]  108.34 27.43 0 top
R34  49.9  [R0402]  111.89 30.61 0 top
R35  49.9  [R0402]  111.89 31.84 0 top
R36  49.9  [R0402]  111.89 37.98 0 top
R37  500  [R0603]  67.82 15.63 270 top
R38  500  [R0603]  72.14 12.07 90 top
R39  1K  [R0603]  30.23 4.08 270 top
R40  500  [R0603]  6.86 106.57 270 top
R41  500  [R0603]  9.4 102.25 90 top
R42  500  [R0603]  5.21 37.86 270 top
R43  500  [R0603]  7.11 33.8 90 top
R44  49.9  [R0402]  108.33 28.63 0 top
R45  49.9  [R0402]  111.89 29.39 0 top
R46  4.7K  [R0603]  87 82.69 90 bottom
R47  4.7K  [R0603]  33.66 15 180 top
R48  4.7K  [R0603]  50.59 81.54 90 top
R49  4.7K  [R0603]  106.55 79.64 90 top
R50  4.7K  [R0603]  107.19 81.8 0 top
R51  4.7K  [R0603]  115.06 78.88 90 top
R52  1k  [R0603]  112.14 81.42 0 top
R53  500  [R0603]  107.31 77.36 180 top
R54  49.9  [R0402]  108.33 26.22 0 top
R55  49.9  [R0402]  111.89 36.75 0 top
R56  22  [R0603]  41.38 81.49 270 top
R57  22  [R0603]  43.92 81.49 270 top
R58  22  [R0603]  46.46 81.49 270 top
R59  22  [R0603]  49.04 81.56 270 top
R60  49.9  [R0402]  108.33 39.47 0 top
R61  240  [R0603]  85.69 34.74 180 top
R62  240  [R0603]  103.89 34.56 180 top
R63  4.7K  [R0603]  85.09 54.12 90 bottom
R64  100  [R0603]  90.17 53.99 270 bottom
R65  100  [R0603]  88.65 53.99 90 bottom
R69  34.8K  [R0603]  25.65 21.73 180 top
R70  100K  [R0603]  26.54 19.44 90 top
R72  2.49K  [R0603]  34.29 34.43 0 top
R73  12K  [R0603]  36.07 32.91 180 top
R74  22  [R0603]  26.54 28.46 180 top
R75  22  [R0603]  49.78 64.78 180 top
R76  4.7K  [R0603]  48.64 38.37 90 bottom
R77  12K  [R0603]  54.53 87.64 90 top
R78  12K  [R0603]  77.6 54.5 0 bottom
R79  12K  [R0603]  77.6 52.97 180 bottom
R80  500  [R0603]  57.15 12.08 270 top
R81  12K  [R0603]  49.4 11.19 90 top
R82  100K  [R0603]  47.88 11.19 270 top
R84  12K  [R0603]  67.18 42.18 270 bottom
R85  22  [R0603]  74.68 55.51 0 top
R88  20K  [R0603]  54.74 23 90 top
R89  20K  [R0603]  57.78 20.21 180 top
R90  20K  [R0603]  64.26 23 90 top
R91  1K  [R0603]  53.09 23 90 top
R92  1K  [R0603]  61.09 20.21 0 top
R93  1K  [R0603]  65.91 23 90 top
R124  12K  [R0603]  108.46 11.06 90 top
R125  100K  [R0603]  108.46 8.01 90 top
R126  500  [R0603]  99.44 12.21 90 top
R127  500  [R0603]  105.03 11.95 270 top
R128  500  [R0603]  12.32 120.28 270 top
R129  500  [R0603]  14.1 116.35 90 top
R130  1K  [R0603]  114.68 15.13 90 top
R131  DNP_1M  [R0603]  3.92 10.03 90 bottom
R174  22  [R0603]  73.15 69.74 180 top
R176  10K  [R0603]  54.48 101.49 270 top
R185  49.9  [R0402]  52.58 122.95 90 top
R186  49.9  [R0402]  53.87 122.95 90 top
R187  49.9  [R0402]  55.15 122.95 90 top
R188  49.9  [R0402]  56.44 122.95 90 top
R189  49.9  [R0402]  57.73 122.95 90 top
R190  49.9  [R0402]  59.02 122.95 90 top
R191  49.9  [R0402]  60.31 122.95 90 top
R192  49.9  [R0402]  61.59 122.95 90 top
R217  22  [R0402]  34.29 18.17 0 top
R218  22  [R0402]  35.94 15.51 270 top
R219  22  [R0402]  37.21 15.51 270 top
R220  22  [R0402]  38.48 15.51 270 top
R221  22  [R0402]  39.75 15.51 270 top
R222  22  [R0402]  48.39 21.98 270 top
R223  22  [R0402]  48.39 24.14 90 top
R224  500  [R0402]  38.73 34.3 270 top
R225  500  [R0402]  43.56 34.3 270 top
R226  12K  [R0402]  30.86 25.16 0 top
R227  47K  [R0402]  23.37 93.36 90 top
R228  200  [R0402]  22.91 91.71 0 top
R229  4.7K  [R0402]  11.68 89.29 90 bottom
R230  4.7K  [R0402]  23.02 85.07 90 top
R231  22  [R0402]  25.27 67.45 180 top
R232  1K  [R0402]  28.07 66.94 90 top
R233  8.06K  [R0402]  22.73 68.47 90 top
R234  12K  [R0402]  21.34 70.75 180 top
R235  4.7K  [R0402]  21.72 73.42 0 top
R236  510  [R0402]  20.7 77.23 0 top
R237  510  [R0402]  23.62 59.58 180 top
R238  510  [R0402]  23.62 44.84 180 top
R239  4.7K  [R0402]  40.05 58.91 270 top
R240  4.7K  [R0402]  41.32 58.91 270 top
R241  4.7K  [R0402]  38.78 58.91 270 top
R242  22  [R0402]  35.6 56.37 90 top
R243  22  [R0402]  38.14 56.62 90 top
R244  22  [R0402]  37 57.13 90 top
R245  1K  [R0402]  42.59 58.91 270 top
R246  1K  [R0402]  45.59 45.23 180 top
R247  1K  [R0402]  47.67 52.69 0 top
R248  1K  [R0402]  47.67 53.96 0 top
R249  1K  [R0402]  47.67 48.88 0 top
R250  2.49K  [R0402]  34.42 56.4 90 bottom
R251  4.7K  [R0402]  47.67 51.42 180 top
R252  4.7K  [R0402]  47.67 50.15 180 top
R253  DNP_4.7K  [R0402]  48.05 45.95 90 top
R254  4.7K  [R0402]  47.67 47.61 180 top
R255  22  [R0402]  45.38 51.42 180 top
R256  22  [R0402]  45.38 50.27 180 top
R257  22  [R0402]  45.38 49.1 180 top
R258  22  [R0402]  45.02 47.93 180 top
R259  22  [R0402]  45.38 52.69 180 top
R260  22  [R0402]  45.38 53.96 180 top
R261  22  [R0402]  62.87 50.56 180 top
R262  22  [R0402]  62.87 54.7 180 top
R263  22  [R0402]  62.87 51.85 180 top
R264  22  [R0402]  62.87 56.12 180 top
R265  22  [R0402]  62.87 53.28 180 top
R266  22  [R0402]  62.87 57.54 180 top
R267  100  [R0201]  99.34 36.02 270 bottom
R268  20k  [R0402]  74.42 53.86 270 top
R269  20k  [R0402]  79.88 54.24 270 bottom
R270  0  [R0603]  50.55 21.6 0 top
R271  0  [R0603]  49.28 25.92 0 top
R272  20K  [R0603]  55.75 39 0 bottom
R273  DNP_0R  [R0603]  54.99 41.29 270 bottom
R274  1K  [R0603]  55.75 37.48 0 bottom
R275  20K  [R0603]  55.75 35.19 0 bottom
R276  DNP_0R  [R0603]  53.34 35.95 270 bottom
R277  1K  [R0603]  53.34 32.91 270 bottom
R278  12K  [R0603]  36.58 42.69 0 top
R279  12K  [R0603]  33.53 42.69 0 top
RJ1  HR911130A  [RJ45-TH_HR911130A]  12.95 52.46 90 top
SW1  -  [SW-SMD_4P-L6.0-W6.0-P4.50-LS9.0-2]  122.81 90.69 0 top
SW2  -  [SW-SMD_4P-L6.0-W6.0-P4.50-LS9.0-2]  42.21 98.94 0 top
SW4  SMXS-03K-TP  [SW-SMD_SMXS-03K-TP]  59.49 26.97 0 top
U1  MT41K256M16TW-107:P  [FBGA-96_L14.0-W8.0-R16-C6-P0.80-TL]  79.47 37.02 0 top
U2  XC7Z020-1CLG484I  [FBGA-484_L19.0-W19.0-R22-C22-P0.80-TL]  88.65 68.09 90 top
U3  MT41K256M16TW-107:P  [FBGA-96_L14.0-W8.0-R16-C6-P0.80-TL]  97.74 36.8 0 top
U4  TPS56628DDAR  [SOIC-8_L4.9-W3.9-P1.27-LS6.0-BL-EP]  23.13 117.96 270 top
U6  TPS56628DDAR  [SOIC-8_L4.9-W3.9-P1.27-LS6.0-BL-EP]  16.53 35.11 270 top
U8  TPS56628DDAR  [SOIC-8_L4.9-W3.9-P1.27-LS6.0-BL-EP]  81.66 13.48 270 top
U10  TPS56628DDAR  [SOIC-8_L4.9-W3.9-P1.27-LS6.0-BL-EP]  18.05 103.7 270 top
U27  GT-USB-7010ASV  [USB-C-SMD_G-SWITCH_GT-USB-7010ASV]  5.21 24.65 270 top
U28  -  [Standoff 3.0mm]  5.67 122.79 0 top
U29  -  [Standoff 3.0mm]  145.49 123.02 0 top
U30  -  [Standoff 3.0mm]  145.75 3.99 0 top
U31  -  [Standoff 3.0mm]  4.14 3.97 0 top
U34  FT2232HL-REEL  [LQFP-64_L10.0-W10.0-P0.50-LS12.0-TL]  40.26 23.89 0 top
U35  RTL8211F-CG  [WQFN-40_L5.0-W5.0-P0.4-BL-EP]  37.51 52.05 270 top
U36  USB3320C-EZK  [QFN-32_L5.0-W5.0-P0.50-BL-EP3.4]  26.16 71.77 90 top
U37  2.2uH AIP0530GX-2R2MPBDG  [Inductor 5.7mm X 5.4mm]  29.84 101.61 90 top
U38  2.2uH AIP0530GX-2R2MPBDG  [Inductor 5.7mm X 5.4mm]  28.32 32.91 90 top
U39  2.2uH AIP0530GX-2R2MPBDG  [Inductor 5.7mm X 5.4mm]  93.47 11.57 90 top
U40  3.3uH AIP0530GX-3R3MPBDG  [Inductor 5.7mm X 5.4mm]  34.8 115.71 90 top
U44  -  [EBBI 68 Plug - 716612568]  138.56 72.91 90 top
U45  -  [EBBI 68 Plug - 716612568]  109.73 116.98 180 top
U60  93LC56B-I/SN  [SOIC-8_L5.0-W4.0-P1.27-LS6.0-BL]  35.18 37.99 270 top
U61  SN74LVC1G07DBVT  [SOT-23-5_L2.9-W1.6-P0.95-LS2.8-BR]  45.85 38.37 180 bottom
U63  W25Q512JVEIQ  [WSON-8_L8.0-W6.0-P1.27-TL-EP]  63.19 37.38 180 bottom
U64  -  [Standoff 2.0mm]  103.08 53.74 0 top
U65  -  [Standoff 2.0mm]  74.37 82.41 0 top
U68  BD3539FVM-TR  [MSOP-8_L2.9-W2.8-P0.65-LS4.0-BL]  111.76 12.46 0 top
U70  25MHz  [OSC-SMD_4P-L2.5-W2.0-BL-1]  34.84 59.04 270 top
U71  -  [Standoff 3.0mm]  10.41 4.08 270 top
U72  13MHz  [OSC-SMD_4P-L2.5-W2.0-BL]  24.75 64.77 0 top
U73  MIC2099-1YMT-TR  [UDFN-6_L1.6-W1.6-P0.50-BL-EP1.2]  21.21 75.45 180 top
U74  TXS02612RTWR  [WQFN-24_L4.0-W4.0-P0.50-TL-EP2.5]  26.89 87.31 90 top
U78  TPD12S016PWR  [TSSOP-24_L7.8-W4.4-P0.65-LS6.4-BL]  57.53 107.07 270 top
U79  47uF  [CAP-SMD_L7.3-W4.3-RD]  18.16 7.38 0 bottom
U80  47uF  [CAP-SMD_L7.3-W4.3-RD]  70.36 116.6 180 top
USB1  678038020  [MICRO-USB-SMD_MOLEX_678038020]  5.33 70.5 270 top
X1  12MHz ECS-2520MV-120-BN-TR  [OSC-SMD_4P-L2.5-W2.0-BL]  22.35 28.33 0 top
X2  33.3MHz ECS-2520MV-333.3-BN-TR  [OSC-SMD_4P-L2.5-W2.0-BL]  46.22 64.93 270 top

## Footprints (pads in the part's own frame, mm; a bottom-side part is the same pattern mirrored in y, then rotated)
C0201
  rect 0.368x0.324 smd: 1(-0.275,0) 2(0.275,0)
C0402
  rect 0.79x0.54 smd: 1(-0.545,0) 2(0.545,0)
C0603
  rect 0.8x0.9 smd: 1(-0.7,0) 2(0.7,0)
C1206
  rect 1.485x1.728 smd: 1(-1.593,0) 2(1.593,0)
CAP-SMD_L3.5-W2.8-FD
  rect 1.9x2.376 smd: 1(-1.798,0) 2(1.798,0)
CAP-SMD_L7.3-W4.3-L-FD
  rect 2.3x3 smd: 1(-3.353,0) 2(3.353,0)
CAP-SMD_L7.3-W4.3-RD
  rect 2.208x2.592 smd: 1(3.511,0) 2(-3.511,0)
D0402
  rect 0.505x0.551 smd: 1(-0.416,0) 2(0.416,0)
DC-IN-TH_DC-5520-1
  oval 4x1.3 hole 3.5x0.8: 2(0.5,-2.4)
  oval 1.3x4 hole 0.8x3.5: 3(-3,2.4) 4(3,2.4)
EBBI 68 Plug - 716612568
  round 1.06 hole 0.8: 1(10.16,5.08) 2(8.89,3.175) 3(7.62,5.08) 4(6.35,3.175) 5(5.08,5.08) 6(3.81,3.175) 7(2.54,5.08) 8(1.27,3.175) 9(0,5.08) 10(-1.27,3.175) 11(-2.54,5.08) 12(-3.81,3.175) 13(-5.08,5.08) 14(-6.35,3.175) 15(-7.62,5.08) 16(-8.89,3.175) 17(-10.16,5.08) 18(-11.43,3.175) 19(-12.7,5.08) 20(-13.97,3.175) 21(-15.24,5.08) 22(-16.51,3.175) 23(-17.78,5.08) 24(-19.05,3.175) 25(-20.32,5.08) 26(-21.59,3.175) 27(-22.86,5.08) 28(-24.13,3.175) 29(-25.4,5.08) 30(-26.67,3.175) 31(-27.94,5.08) 32(-29.21,3.175) 33(-30.48,5.08) 34(-31.75,3.175) 35(10.16,1.27) 36(8.89,-0.635) 37(7.62,1.27) 38(6.35,-0.635) 39(5.08,1.27) 40(3.81,-0.635) 41(2.54,1.27) 42(1.27,-0.635) 43(0,1.27) 44(-1.27,-0.635) 45(-2.54,1.27) 46(-3.81,-0.635) 47(-5.08,1.27) 48(-6.35,-0.635) 49(-7.62,1.27) 50(-8.89,-0.635) 51(-10.16,1.27) 52(-11.43,-0.635) 53(-12.7,1.27) 54(-13.97,-0.635) 55(-15.24,1.27) 56(-16.51,-0.635) 57(-17.78,1.27) 58(-19.05,-0.635) 59(-20.32,1.27) 60(-21.59,-0.635) 61(-22.86,1.27) 62(-24.13,-0.635) 63(-25.4,1.27) 64(-26.67,-0.635) 65(-27.94,1.27) 66(-29.21,-0.635) 67(-30.48,1.27) 68(-31.75,-0.635)
  round 3.06 hole 2.6: GND1(-35.456,-0.64) GND2(13.888,-0.64)
F1206
  rect 1.19x1.728 smd: 1(-1.445,0) 2(1.445,0)
F1210
  rect 1.485x2.781 smd: 1(-1.6,0) 2(1.6,0)
FBGA-96_L14.0-W8.0-R16-C6-P0.80-TL
  round 0.394 smd: A1(-3.2,6) A2(-2.4,6) A3(-1.6,6) A7(1.6,6) A8(2.4,6) A9(3.2,6) B1(-3.2,5.2) B2(-2.4,5.2) B3(-1.6,5.2) B7(1.6,5.2) B8(2.4,5.2) B9(3.2,5.2) C1(-3.2,4.4) C2(-2.4,4.4) C3(-1.6,4.4) C7(1.6,4.4) C8(2.4,4.4) C9(3.2,4.4) D1(-3.2,3.6) D2(-2.4,3.6) D3(-1.6,3.6) D7(1.6,3.6) D8(2.4,3.6) D9(3.2,3.6) E1(-3.2,2.8) E2(-2.4,2.8) E3(-1.6,2.8) E7(1.6,2.8) E8(2.4,2.8) E9(3.2,2.8) F1(-3.2,2) F2(-2.4,2) F3(-1.6,2) F7(1.6,2) F8(2.4,2) F9(3.2,2) G1(-3.2,1.2) G2(-2.4,1.2) G3(-1.6,1.2) G7(1.6,1.2) G8(2.4,1.2) G9(3.2,1.2) H1(-3.2,0.4) H2(-2.4,0.4) H3(-1.6,0.4) H7(1.6,0.4) H8(2.4,0.4) H9(3.2,0.4) J1(-3.2,-0.4) J2(-2.4,-0.4) J3(-1.6,-0.4) J7(1.6,-0.4) J8(2.4,-0.4) J9(3.2,-0.4) K1(-3.2,-1.2) K2(-2.4,-1.2) K3(-1.6,-1.2) K7(1.6,-1.2) K8(2.4,-1.2) K9(3.2,-1.2) L1(-3.2,-2) L2(-2.4,-2) L3(-1.6,-2) L7(1.6,-2) L8(2.4,-2) L9(3.2,-2) M1(-3.2,-2.8) M2(-2.4,-2.8) M3(-1.6,-2.8) M7(1.6,-2.8) M8(2.4,-2.8) M9(3.2,-2.8) N1(-3.2,-3.6) N2(-2.4,-3.6) N3(-1.6,-3.6) N7(1.6,-3.6) N8(2.4,-3.6) N9(3.2,-3.6) P1(-3.2,-4.4) P2(-2.4,-4.4) P3(-1.6,-4.4) P7(1.6,-4.4) P8(2.4,-4.4) P9(3.2,-4.4) R1(-3.2,-5.2) R2(-2.4,-5.2) R3(-1.6,-5.2) R7(1.6,-5.2) R8(2.4,-5.2) R9(3.2,-5.2) T1(-3.2,-6) T2(-2.4,-6) T3(-1.6,-6) T7(1.6,-6) T8(2.4,-6) T9(3.2,-6)
FBGA-484_L19.0-W19.0-R22-C22-P0.80-TL
  round 0.34 smd: A1(-8.4,8.4) A2(-7.6,8.4) A3(-6.8,8.4) A4(-6,8.4) A5(-5.2,8.4) A6(-4.4,8.4) A7(-3.6,8.4) A8(-2.8,8.4) A9(-2,8.4) A10(-1.2,8.4) A11(-0.4,8.4) A12(0.4,8.4) A13(1.2,8.4) A14(2,8.4) A15(2.8,8.4) A16(3.6,8.4) A17(4.4,8.4) A18(5.2,8.4) A19(6,8.4) A20(6.8,8.4) A21(7.6,8.4) A22(8.4,8.4) AA1(-8.4,-7.6) AA2(-7.6,-7.6) AA3(-6.8,-7.6) AA4(-6,-7.6) AA5(-5.2,-7.6) AA6(-4.4,-7.6) AA7(-3.6,-7.6) AA8(-2.8,-7.6) AA9(-2,-7.6) AA10(-1.2,-7.6) AA11(-0.4,-7.6) AA12(0.4,-7.6) AA13(1.2,-7.6) AA14(2,-7.6) AA15(2.8,-7.6) AA16(3.6,-7.6) AA17(4.4,-7.6) AA18(5.2,-7.6) AA19(6,-7.6) AA20(6.8,-7.6) AA21(7.6,-7.6) AA22(8.4,-7.6) AB1(-8.4,-8.4) AB2(-7.6,-8.4) AB3(-6.8,-8.4) AB4(-6,-8.4) AB5(-5.2,-8.4) AB6(-4.4,-8.4) AB7(-3.6,-8.4) AB8(-2.8,-8.4) AB9(-2,-8.4) AB10(-1.2,-8.4) AB11(-0.4,-8.4) AB12(0.4,-8.4) AB13(1.2,-8.4) AB14(2,-8.4) AB15(2.8,-8.4) AB16(3.6,-8.4) AB17(4.4,-8.4) AB18(5.2,-8.4) AB19(6,-8.4) AB20(6.8,-8.4) AB21(7.6,-8.4) AB22(8.4,-8.4) B1(-8.4,7.6) B2(-7.6,7.6) B3(-6.8,7.6) B4(-6,7.6) B5(-5.2,7.6) B6(-4.4,7.6) B7(-3.6,7.6) B8(-2.8,7.6) B9(-2,7.6) B10(-1.2,7.6) B11(-0.4,7.6) B12(0.4,7.6) B13(1.2,7.6) B14(2,7.6) B15(2.8,7.6) B16(3.6,7.6) B17(4.4,7.6) B18(5.2,7.6) B19(6,7.6) B20(6.8,7.6) B21(7.6,7.6) B22(8.4,7.6) C1(-8.4,6.8) C2(-7.6,6.8) C3(-6.8,6.8) C4(-6,6.8) C5(-5.2,6.8) C6(-4.4,6.8) C7(-3.6,6.8) C8(-2.8,6.8) C9(-2,6.8) C10(-1.2,6.8) C11(-0.4,6.8) C12(0.4,6.8) C13(1.2,6.8) C14(2,6.8) C15(2.8,6.8) C16(3.6,6.8) C17(4.4,6.8) C18(5.2,6.8) C19(6,6.8) C20(6.8,6.8) C21(7.6,6.8) C22(8.4,6.8) D1(-8.4,6) D2(-7.6,6) D3(-6.8,6) D4(-6,6) D5(-5.2,6) D6(-4.4,6) D7(-3.6,6) D8(-2.8,6) D9(-2,6) D10(-1.2,6) D11(-0.4,6) D12(0.4,6) D13(1.2,6) D14(2,6) D15(2.8,6) D16(3.6,6) D17(4.4,6) D18(5.2,6) D19(6,6) D20(6.8,6) D21(7.6,6) D22(8.4,6) E1(-8.4,5.2) E2(-7.6,5.2) E3(-6.8,5.2) E4(-6,5.2) E5(-5.2,5.2) E6(-4.4,5.2) E7(-3.6,5.2) E8(-2.8,5.2) E9(-2,5.2) E10(-1.2,5.2) E11(-0.4,5.2) E12(0.4,5.2) E13(1.2,5.2) E14(2,5.2) E15(2.8,5.2) E16(3.6,5.2) E17(4.4,5.2) E18(5.2,5.2) E19(6,5.2) E20(6.8,5.2) E21(7.6,5.2) E22(8.4,5.2) F1(-8.4,4.4) F2(-7.6,4.4) F3(-6.8,4.4) F4(-6,4.4) F5(-5.2,4.4) F6(-4.4,4.4) F7(-3.6,4.4) F8(-2.8,4.4) F9(-2,4.4) F10(-1.2,4.4) F11(-0.4,4.4) F12(0.4,4.4) F13(1.2,4.4) F14(2,4.4) F15(2.8,4.4) F16(3.6,4.4) F17(4.4,4.4) F18(5.2,4.4) F19(6,4.4) F20(6.8,4.4) F21(7.6,4.4) F22(8.4,4.4) G1(-8.4,3.6) G2(-7.6,3.6) G3(-6.8,3.6) G4(-6,3.6) G5(-5.2,3.6) G6(-4.4,3.6) G7(-3.6,3.6) G8(-2.8,3.6) G9(-2,3.6) G10(-1.2,3.6) G11(-0.4,3.6) G12(0.4,3.6) G13(1.2,3.6) G14(2,3.6) G15(2.8,3.6) G16(3.6,3.6) G17(4.4,3.6) G18(5.2,3.6) G19(6,3.6) G20(6.8,3.6) G21(7.6,3.6) G22(8.4,3.6) H1(-8.4,2.8) H2(-7.6,2.8) H3(-6.8,2.8) H4(-6,2.8) H5(-5.2,2.8) H6(-4.4,2.8) H7(-3.6,2.8) H8(-2.8,2.8) H9(-2,2.8) H10(-1.2,2.8) H11(-0.4,2.8) H12(0.4,2.8) H13(1.2,2.8) H14(2,2.8) H15(2.8,2.8) H16(3.6,2.8) H17(4.4,2.8) H18(5.2,2.8) H19(6,2.8) H20(6.8,2.8) H21(7.6,2.8) H22(8.4,2.8) J1(-8.4,2) J2(-7.6,2) J3(-6.8,2) J4(-6,2) J5(-5.2,2) J6(-4.4,2) J7(-3.6,2) J8(-2.8,2) J9(-2,2) J10(-1.2,2) J11(-0.4,2) J12(0.4,2) J13(1.2,2) J14(2,2) J15(2.8,2) J16(3.6,2) J17(4.4,2) J18(5.2,2) J19(6,2) J20(6.8,2) J21(7.6,2) J22(8.4,2) K1(-8.4,1.2) K2(-7.6,1.2) K3(-6.8,1.2) K4(-6,1.2) K5(-5.2,1.2) K6(-4.4,1.2) K7(-3.6,1.2) K8(-2.8,1.2) K9(-2,1.2) K10(-1.2,1.2) K11(-0.4,1.2) K12(0.4,1.2) K13(1.2,1.2) K14(2,1.2) K15(2.8,1.2) K16(3.6,1.2) K17(4.4,1.2) K18(5.2,1.2) K19(6,1.2) K20(6.8,1.2) K21(7.6,1.2) K22(8.4,1.2) L1(-8.4,0.4) L2(-7.6,0.4) L3(-6.8,0.4) L4(-6,0.4) L5(-5.2,0.4) L6(-4.4,0.4) L7(-3.6,0.4) L8(-2.8,0.4) L9(-2,0.4) L10(-1.2,0.4) L11(-0.4,0.4) L12(0.4,0.4) L13(1.2,0.4) L14(2,0.4) L15(2.8,0.4) L16(3.6,0.4) L17(4.4,0.4) L18(5.2,0.4) L19(6,0.4) L20(6.8,0.4) L21(7.6,0.4) L22(8.4,0.4) M1(-8.4,-0.4) M2(-7.6,-0.4) M3(-6.8,-0.4) M4(-6,-0.4) M5(-5.2,-0.4) M6(-4.4,-0.4) M7(-3.6,-0.4) M8(-2.8,-0.4) M9(-2,-0.4) M10(-1.2,-0.4) M11(-0.4,-0.4) M12(0.4,-0.4) M13(1.2,-0.4) M14(2,-0.4) M15(2.8,-0.4) M16(3.6,-0.4) M17(4.4,-0.4) M18(5.2,-0.4) M19(6,-0.4) M20(6.8,-0.4) M21(7.6,-0.4) M22(8.4,-0.4) N1(-8.4,-1.2) N2(-7.6,-1.2) N3(-6.8,-1.2) N4(-6,-1.2) N5(-5.2,-1.2) N6(-4.4,-1.2) N7(-3.6,-1.2) N8(-2.8,-1.2) N9(-2,-1.2) N10(-1.2,-1.2) N11(-0.4,-1.2) N12(0.4,-1.2) N13(1.2,-1.2) N14(2,-1.2) N15(2.8,-1.2) N16(3.6,-1.2) N17(4.4,-1.2) N18(5.2,-1.2) N19(6,-1.2) N20(6.8,-1.2) N21(7.6,-1.2) N22(8.4,-1.2) P1(-8.4,-2) P2(-7.6,-2) P3(-6.8,-2) P4(-6,-2) P5(-5.2,-2) P6(-4.4,-2) P7(-3.6,-2) P8(-2.8,-2) P9(-2,-2) P10(-1.2,-2) P11(-0.4,-2) P12(0.4,-2) P13(1.2,-2) P14(2,-2) P15(2.8,-2) P16(3.6,-2) P17(4.4,-2) P18(5.2,-2) P19(6,-2) P20(6.8,-2) P21(7.6,-2) P22(8.4,-2) R1(-8.4,-2.8) R2(-7.6,-2.8) R3(-6.8,-2.8) R4(-6,-2.8) R5(-5.2,-2.8) R6(-4.4,-2.8) R7(-3.6,-2.8) R8(-2.8,-2.8) R9(-2,-2.8) R10(-1.2,-2.8) R11(-0.4,-2.8) R12(0.4,-2.8) R13(1.2,-2.8) R14(2,-2.8) R15(2.8,-2.8) R16(3.6,-2.8) R17(4.4,-2.8) R18(5.2,-2.8) R19(6,-2.8) R20(6.8,-2.8) R21(7.6,-2.8) R22(8.4,-2.8) T1(-8.4,-3.6) T2(-7.6,-3.6) T3(-6.8,-3.6) T4(-6,-3.6) T5(-5.2,-3.6) T6(-4.4,-3.6) T7(-3.6,-3.6) T8(-2.8,-3.6) T9(-2,-3.6) T10(-1.2,-3.6) T11(-0.4,-3.6) T12(0.4,-3.6) T13(1.2,-3.6) T14(2,-3.6) T15(2.8,-3.6) T16(3.6,-3.6) T17(4.4,-3.6) T18(5.2,-3.6) T19(6,-3.6) T20(6.8,-3.6) T21(7.6,-3.6) T22(8.4,-3.6) U1(-8.4,-4.4) U2(-7.6,-4.4) U3(-6.8,-4.4) U4(-6,-4.4) U5(-5.2,-4.4) U6(-4.4,-4.4) U7(-3.6,-4.4) U8(-2.8,-4.4) U9(-2,-4.4) U10(-1.2,-4.4) U11(-0.4,-4.4) U12(0.4,-4.4) U13(1.2,-4.4) U14(2,-4.4) U15(2.8,-4.4) U16(3.6,-4.4) U17(4.4,-4.4) U18(5.2,-4.4) U19(6,-4.4) U20(6.8,-4.4) U21(7.6,-4.4) U22(8.4,-4.4) V1(-8.4,-5.2) V2(-7.6,-5.2) V3(-6.8,-5.2) V4(-6,-5.2) V5(-5.2,-5.2) V6(-4.4,-5.2) V7(-3.6,-5.2) V8(-2.8,-5.2) V9(-2,-5.2) V10(-1.2,-5.2) V11(-0.4,-5.2) V12(0.4,-5.2) V13(1.2,-5.2) V14(2,-5.2) V15(2.8,-5.2) V16(3.6,-5.2) V17(4.4,-5.2) V18(5.2,-5.2) V19(6,-5.2) V20(6.8,-5.2) V21(7.6,-5.2) V22(8.4,-5.2) W1(-8.4,-6) W2(-7.6,-6) W3(-6.8,-6) W4(-6,-6) W5(-5.2,-6) W6(-4.4,-6) W7(-3.6,-6) W8(-2.8,-6) W9(-2,-6) W10(-1.2,-6) W11(-0.4,-6) W12(0.4,-6) W13(1.2,-6) W14(2,-6) W15(2.8,-6) W16(3.6,-6) W17(4.4,-6) W18(5.2,-6) W19(6,-6) W20(6.8,-6) W21(7.6,-6) W22(8.4,-6) Y1(-8.4,-6.8) Y2(-7.6,-6.8) Y3(-6.8,-6.8) Y4(-6,-6.8) Y5(-5.2,-6.8) Y6(-4.4,-6.8) Y7(-3.6,-6.8) Y8(-2.8,-6.8) Y9(-2,-6.8) Y10(-1.2,-6.8) Y11(-0.4,-6.8) Y12(0.4,-6.8) Y13(1.2,-6.8) Y14(2,-6.8) Y15(2.8,-6.8) Y16(3.6,-6.8) Y17(4.4,-6.8) Y18(5.2,-6.8) Y19(6,-6.8) Y20(6.8,-6.8) Y21(7.6,-6.8) Y22(8.4,-6.8)
HDMI-SMD_10029449-001RLF
  rect 0.3x1.9 smd: 1(4.75,2.95) 2(4.25,2.95) 3(3.75,2.95) 4(3.25,2.95) 5(2.75,2.95) 6(2.25,2.95) 7(1.75,2.95) 8(1.25,2.95) 9(0.75,2.95) 10(0.25,2.95) 11(-0.25,2.95) 12(-0.75,2.95) 13(-1.25,2.95) 14(-1.75,2.95) 15(-2.25,2.95) 16(-2.75,2.95) 17(-3.25,2.95) 18(-3.75,2.95) 19(-4.25,2.95)
  round 2 hole 1.3: 20(-7.85,-2.95) 20(-7.25,1.95) 20(7.25,1.95) 20(7.85,-2.95)
HDR-SMD_8P-P1.27-V-M-C2-C4-LS5.3
  rect 0.74x2.4 smd: 1(-1.905,-1.95) 2(-1.905,1.95) 3(-0.635,-1.95) 4(-0.635,1.95) 5(0.635,-1.95) 6(0.635,1.95) 7(1.905,-1.95) 8(1.905,1.95)
HDR-SMD_14P-P2.54-V-M-R2-C7-LS7.4
  rect 1.27x2.8 smd: 1(-7.62,-2.8) 2(-7.62,2.8) 3(-5.08,-2.8) 4(-5.08,2.8) 5(-2.54,-2.8) 6(-2.54,2.8) 7(0,-2.8) 8(0,2.8) 9(2.54,-2.8) 10(2.54,2.8) 11(5.08,-2.8) 12(5.08,2.8) 13(7.62,-2.8) 14(7.62,2.8)
HDR-TH_2P-P2.54-V-M
  rect 2x2 hole 1.2: 1(-1.27,0)
  round 2 hole 1.2: 2(1.27,0)
HDR-TH_3P-P2.54-V-M-1
  rect 1.575x1.8 hole 1.2: 1(-2.54,0)
  round 1.8 hole 1.2: 2(0,0) 3(2.54,0)
Inductor 5.7mm X 5.4mm
  rect 3x4.7 smd: 1(0.381,2.699) 2(5.334,2.699)
L0603
  rect 0.8x0.864 smd: 1(-0.7,0) 2(0.7,0)
L0805
  rect 1.133x1.377 smd: 1(-0.966,0) 2(0.966,0)
LED0603-R-RD
  rect 0.8x0.8 smd: 1(0.851,0) 2(-0.851,0)
LED0603-RD_GREEN
  rect 0.8x0.8 smd: 1(-0.799,-0.004) 2(0.799,0.004)
LQFP-64_L10.0-W10.0-P0.50-LS12.0-TL
  oval 1.8x0.28 smd: 1(-5.55,3.75) 2(-5.55,3.25) 3(-5.55,2.75) 4(-5.55,2.25) 5(-5.55,1.75) 6(-5.55,1.25) 7(-5.55,0.75) 8(-5.55,0.25) 9(-5.55,-0.25) 10(-5.55,-0.75) 11(-5.55,-1.25) 12(-5.55,-1.75) 13(-5.55,-2.25) 14(-5.55,-2.75) 15(-5.55,-3.25) 16(-5.55,-3.75) 33(5.55,-3.75) 34(5.55,-3.25) 35(5.55,-2.75) 36(5.55,-2.25) 37(5.55,-1.75) 38(5.55,-1.25) 39(5.55,-0.75) 40(5.55,-0.25) 41(5.55,0.25) 42(5.55,0.75) 43(5.55,1.25) 44(5.55,1.75) 45(5.55,2.25) 46(5.55,2.75) 47(5.55,3.25) 48(5.55,3.75)
  oval 0.28x1.8 smd: 17(-3.75,-5.55) 18(-3.25,-5.55) 19(-2.75,-5.55) 20(-2.25,-5.55) 21(-1.75,-5.55) 22(-1.25,-5.55) 23(-0.75,-5.55) 24(-0.25,-5.55) 25(0.25,-5.55) 26(0.75,-5.55) 27(1.25,-5.55) 28(1.75,-5.55) 29(2.25,-5.55) 30(2.75,-5.55) 31(3.25,-5.55) 32(3.75,-5.55) 49(3.75,5.55) 50(3.25,5.55) 51(2.75,5.55) 52(2.25,5.55) 53(1.75,5.55) 54(1.25,5.55) 55(0.75,5.55) 56(0.25,5.55) 57(-0.25,5.55) 58(-0.75,5.55) 59(-1.25,5.55) 60(-1.75,5.55) 61(-2.25,5.55) 62(-2.75,5.55) 63(-3.25,5.55) 64(-3.75,5.55)
MICRO-USB-SMD_MOLEX_678038020
  rect 0.5x2.3 smd: 1(-1.6,2.7) 2(-0.8,2.7) 3(0,2.7) 4(0.8,2.7) 5(1.6,2.7)
  rect 2.1x3.5 smd: 6(4.95,2.7) 7(4.95,-1.55) 8(-4.95,-1.55) 9(-4.95,2.7)
  rect 6.2x1.2 smd: 10(0,-2.7)
MSOP-8_L2.9-W2.8-P0.65-LS4.0-BL
  oval 0.4x1.1 smd: 1(-0.975,-1.9) 2(-0.325,-1.9) 3(0.325,-1.9) 4(0.975,-1.9) 5(0.976,1.9) 6(0.325,1.9) 7(-0.325,1.9) 8(-0.976,1.9)
OSC-SMD_4P-L2.5-W2.0-BL
  rect 1.2x1.1 smd: 1(-0.95,-0.75) 2(0.95,-0.75) 3(0.95,0.75) 4(-0.95,0.75)
OSC-SMD_4P-L2.5-W2.0-BL-1
  rect 0.9x0.8 smd: 1(-0.925,-0.725) 2(0.925,-0.725) 3(0.925,0.725) 4(-0.925,0.725)
QFN-32_L5.0-W5.0-P0.50-BL-EP3.4
  rect 0.28x0.8 smd: 1(-1.75,-2.5) 2(-1.252,-2.5) 3(-0.751,-2.5) 4(-0.252,-2.5) 5(0.248,-2.5) 6(0.749,-2.5) 7(1.248,-2.5) 8(1.748,-2.5) 17(1.752,2.5) 18(1.252,2.5) 19(0.751,2.5) 20(0.252,2.5) 21(-0.248,2.5) 22(-0.749,2.5) 23(-1.248,2.5) 24(-1.748,2.5)
  rect 0.8x0.28 smd: 9(2.5,-1.748) 10(2.5,-1.248) 11(2.5,-0.748) 12(2.5,-0.248) 13(2.5,0.252) 14(2.5,0.752) 15(2.5,1.252) 16(2.5,1.752) 25(-2.5,1.75) 26(-2.5,1.25) 27(-2.5,0.75) 28(-2.5,0.25) 29(-2.5,-0.25) 30(-2.5,-0.75) 31(-2.5,-1.25) 32(-2.5,-1.75)
  rect 3.4x3.4 smd: 33(0,0)
R0201
  rect 0.303x0.324 smd: 1(-0.241,0) 2(0.241,0)
R0402
  rect 0.566x0.54 smd: 1(-0.433,0) 2(0.433,0)
R0603
  rect 0.806x0.864 smd: 1(-0.753,0) 2(0.753,0)
RJ45-TH_HR911130A
  round 1.7 hole 1.1: 11(6.625,6.895) 12(4.085,6.895) 13(-4.085,6.895) 14(-6.625,6.895)
  rect 1.524x1.524 hole 0.91: P1(5.72,-6.895)
  round 1.524 hole 0.91: P2(4.549,-4.355) P3(3.18,-6.895) P4(2.009,-4.355) P5(0.64,-6.895) P6(-0.531,-4.355) P7(-1.9,-6.895) P8(-3.071,-4.355) P9(-4.44,-6.895) P10(-5.611,-4.355)
  round 2.159 hole 1.7: SHIELD0(-7.745,-1.056) SHIELD1(7.745,-1.056)
SOD-323_L1.8-W1.3-LS2.5-RD
  rect 1x0.75 smd: 1(-1.173,0) 2(1.173,0)
SOIC-8_L4.9-W3.9-P1.27-LS6.0-BL-EP
  oval 0.602x1.941 smd: 1(-1.905,-2.72) 2(-0.635,-2.72) 3(0.635,-2.72) 4(1.905,-2.72) 5(1.905,2.72) 6(0.635,2.72) 7(-0.635,2.72) 8(-1.905,2.72)
  rect 3.098x2.41 smd: 9(0,0)
SOIC-8_L5.0-W4.0-P1.27-LS6.0-BL
  oval 0.569x1.95 smd: 1(-1.905,-2.705) 2(-0.635,-2.705) 3(0.635,-2.705) 4(1.905,-2.705) 5(1.905,2.705) 6(0.635,2.705) 7(-0.635,2.705) 8(-1.905,2.705)
SOT-23-3_L2.9-W1.3-P1.90-LS2.4-BR
  rect 1.25x0.7 smd: 1(1,-0.95) 2(1,0.95) 3(-1,0)
SOT-23-5_L2.9-W1.6-P0.95-LS2.8-BR
  rect 1x0.6 smd: 1(1.1,-0.95) 2(1.1,0) 3(1.1,0.95) 4(-1.1,0.95) 5(-1.1,-0.95)
Standoff 2.0mm
  round 3 hole 3x2: 1(0,0)
Standoff 3.0mm
  round 6 hole 3: 1(0,0)
SW-SMD_4P-L6.0-W6.0-P4.50-LS9.0-2
  rect 2.3x1.5 smd: 1(-4.55,2.25) 2(4.55,2.25) 3(-4.55,-2.25) 4(4.55,-2.25)
SW-SMD_SMXS-03K-TP
  rect 1.1x2.2 smd: 1(-2.54,-4.4) 2(0,-4.4) 3(2.54,-4.4) 4(2.54,4.4) 5(0,4.4) 6(-2.54,4.4)
TF-SMD_TF-02
  rect 0.7x1.6 smd: 1(2.245,5.3) 2(1.145,5.3) 3(0.046,5.3) 4(-1.054,5.3) 5(-2.155,5.3) 6(-3.255,5.3) 7(-4.354,5.3) 8(-5.454,5.3) 9(-6.554,5.3)
  rect 1.2x1.5 smd: 10(-7.754,4.3)
  rect 1.2x2.2 smd: 11(-7.746,-5.3) 12(7.754,-5.3)
  rect 1.6x1.5 smd: 13(6.854,4.3)
TO-236AB_L2.9-W1.3-P0.95-LS2.3-BR
  rect 1.4x0.6 smd: 1(1.05,-0.95) 2(1.05,0.95) 3(-1.05,0)
TSSOP-24_L7.8-W4.4-P0.65-LS6.4-BL
  rect 0.4x1.65 smd: 1(-3.575,-3.022) 2(-2.925,-3.022) 3(-2.275,-3.022) 4(-1.625,-3.022) 5(-0.975,-3.022) 6(-0.325,-3.022) 7(0.325,-3.022) 8(0.975,-3.022) 9(1.625,-3.022) 10(2.275,-3.022) 11(2.925,-3.022) 12(3.575,-3.022) 13(3.575,3.022) 14(2.925,3.022) 15(2.275,3.022) 16(1.625,3.022) 17(0.975,3.022) 18(0.325,3.022) 19(-0.325,3.022) 20(-0.975,3.022) 21(-1.625,3.022) 22(-2.275,3.022) 23(-2.925,3.022) 24(-3.575,3.022)
UDFN-6_L1.6-W1.6-P0.50-BL-EP1.2
  rect 0.28x0.585 smd: 1(-0.5,-0.767) 2(0,-0.767) 3(0.5,-0.767) 4(0.5,0.767) 5(0,0.767) 6(-0.5,0.767)
  rect 1.2x0.5 smd: 7(0,0)
USB-C-SMD_G-SWITCH_GT-USB-7010ASV
  oval 1x2.1 hole 0.6x1.7: 1(-4.32,1.78) 2(4.32,1.78)
  oval 1x1.8 hole 0.6x1.4: 3(4.32,-2.4) 4(-4.32,-2.4)
  rect 0.6x1.24 smd: A1B12(-3.2,2.4) A4B9(-2.4,2.4) B1A12(3.2,2.4) B4A9(2.4,2.4)
  rect 0.3x1.24 smd: A5(-1.25,2.4) A6(-0.25,2.4) A7(0.25,2.4) A8(1.25,2.4) B5(1.75,2.4) B6(0.75,2.4) B7(-0.75,2.4) B8(-1.75,2.4)
WQFN-24_L4.0-W4.0-P0.50-TL-EP2.5
  rect 0.85x0.25 smd: 1(-2.025,1.245) 2(-2.025,0.744) 3(-2.025,0.244) 4(-2.025,-0.257) 5(-2.025,-0.754) 6(-2.025,-1.255) 13(2.025,-1.255) 14(2.025,-0.754) 15(2.025,-0.257) 16(2.025,0.244) 17(2.025,0.744) 18(2.025,1.244)
  rect 0.25x0.85 smd: 7(-1.254,-2.025) 8(-0.756,-2.025) 9(-0.256,-2.025) 10(0.244,-2.025) 11(0.745,-2.025) 12(1.245,-2.025) 19(1.245,2.025) 20(0.745,2.025) 21(0.244,2.025) 22(-0.256,2.025) 23(-0.756,2.025) 24(-1.254,2.025)
  rect 2.5x2.5 smd: 25(0.001,0)
WQFN-40_L5.0-W5.0-P0.4-BL-EP
  oval 0.2x0.8 smd: 1(-1.801,-2.499) 2(-1.399,-2.499) 3(-1.001,-2.499) 4(-0.6,-2.499) 5(-0.201,-2.499) 6(0.201,-2.499) 7(0.6,-2.499) 8(1.001,-2.499) 9(1.399,-2.499) 10(1.801,-2.499) 21(1.801,2.499) 22(1.399,2.499) 23(1.001,2.499) 24(0.6,2.499) 25(0.201,2.499) 26(-0.201,2.499) 27(-0.6,2.499) 28(-1.001,2.499) 29(-1.399,2.499) 30(-1.801,2.499)
  oval 0.8x0.2 smd: 11(2.499,-1.801) 12(2.499,-1.399) 13(2.499,-1.001) 14(2.499,-0.6) 15(2.499,-0.201) 16(2.499,0.201) 17(2.499,0.6) 18(2.499,1.001) 19(2.499,1.399) 20(2.499,1.801) 31(-2.499,1.801) 32(-2.499,1.399) 33(-2.499,1.001) 34(-2.499,0.6) 35(-2.499,0.201) 36(-2.499,-0.201) 37(-2.499,-0.6) 38(-2.499,-1.001) 39(-2.499,-1.399) 40(-2.499,-1.801)
  rect 3.8x3.8 smd: 41(0,0)
WSON-8_L8.0-W6.0-P1.27-TL-EP
  rect 1x0.7 smd: 1(-4,1.905) 2(-4,0.635) 3(-4,-0.635) 4(-4,-1.905) 5(4,-1.905) 6(4,-0.635) 7(4,0.635) 8(4,1.905)
  rect 4.65x5.2 smd: 9(0,0)

## Nets
As in the schematic.

Pads without a net: CN2 14; HDR1 12; RJ1 P1; U1 J1 J9 L1 L9 M7; U2 A16 A17 A21 A22 AA13 AA14 AA16 AA17 AA22 AB14 AB15 AB16 AB17 AB19 AB20 AB21 AB22 B15 B21 B22 C15 C22 D15 D16 D17 D21 D22 E15 E16 E18 E19 E20 E21 F16 F17 F18 F19 F21 F22 G10 G15 G16 G17 G19 G20 G21 G22 H17 H18 H19 H22 J15 J16 J17 J18 J20 J21 J22 K15 K18 K21 L16 L17 L18 L19 L21 L22 M15 M16 M17 N15 N17 N18 P15 P16 P17 P18 P20 P21 R7 R16 R18 R19 R20 R21 T16 T17 T18 T19 U9 U10 U11 U12 U14 U15 U16 U17 V8 V9 V10 V12 V13 V14 V15 V17 W8 W10 W11 W12 W13 W15 W16 W17 W18 Y13 Y14 Y15 Y16; U3 J1 J9 L1 L9 M7; U27 A5 A8 B5 B6 B7 B8; U34 3 23 24 26 27 28 29 30 32 33 34 36 40 41 43 44 45 46 48 52 53 57 58 59 60; U36 12 15 16 25; U60 6 7; U61 1; U73 3; U74 8 10 12 13 14 15

## Via types
v1: diameter 0.7, hole 0.35, Top Layer to Bottom Layer, 121 vias
v2: diameter 0.4, hole 0.3, Top Layer to Bottom Layer, 1098 vias
v3: diameter 1.5, hole 1, Top Layer to Bottom Layer, 1 via
v4: diameter 1, hole 0.6, Top Layer to Bottom Layer, 146 vias
v5: diameter 0.45, hole 0.3, Top Layer to Bottom Layer, 11 vias
v6: diameter 0.8, hole 0.5, Top Layer to Bottom Layer, 10 vias
v7: diameter 1.6, hole 0.9, Top Layer to Bottom Layer, 14 vias
v8: diameter 0.5, hole 0.3, Top Layer to Bottom Layer, 1 via

## Routing (per net, layer and track width the routed paths; a pad name or vN(x,y) marks a point on that pad's centre or on a via; arc(x,y) is an arc through that point)
0V675: length 62.1
  Top Layer w0.254: C220.1 108.84,15.7 C221.1 ; v1(108.08,15.63) 106.43,13.98 106.43,12.59 R127.2 105.16,11.07 v1(105.16,10.17) ; U68.8 110.78,15.07 v2(110.73,15.13) ; U68.8 110.41,13.98 v2(110.36,13.98) ; U68.8 110.75,14.39 v2(110.32,14.39)
  Top Layer w0.305: U68.3 112.09,11.3 v2(112.07,11.32) ; 110.78,14.41 v2(110.32,14.88) 109.62,15.57 C220.1 ; U68.8 110.78,13.74 v2(110.79,13.73)
  Top Layer w0.5: v2(109.27,28.63) R44.2 ; R34.2 R45.2 ; R34.2 R35.2 ; R34.2 v2(112.83,30.61) ; R45.2 R32.2 v2(112.83,28.16) ; R45.2 v2(112.83,29.39) ; v2(114.45,32.27) C44.1 ; R23.2 v2(109.3,35.86) ; v2(114.45,35.61) C43.1 ; v2(109.28,32.26) R31.2 ; v2(114.35,41.37) 115.05,41.37 C93.1 C92.1 ; R55.2 R24.2 ; R55.2 R36.2 ; R55.2 v2(112.83,36.75) ; R24.2 v2(112.83,35.52) ; R24.2 R27.2 ; v2(114.44,26.05) 115.01,26.05 C90.1 C91.1 ; v2(109.28,41.87) 108.76,41.87 ; R27.2 R30.2 ; R27.2 v2(112.83,34.3) ; R30.2 R35.2 ; R30.2 v2(112.83,33.07) ; v2(109.27,40.67) R20.2 ; v2(112.83,37.98) R36.2 ; R36.2 R18.2 v2(112.83,39.21) ; v2(114.39,38.88) C76.1 ; v2(109.28,27.43) R33.2 ; R25.2 v2(109.29,34.66) ; v2(114.3,27.89) C41.1 ; R22.2 v2(109.29,37.07) ; R35.2 v2(112.83,31.84) ; C92.1 115.05,36.99 v2(114.44,36.99) ; C92.1 C91.1 ; v2(114.3,29) C74.1 ; v2(109.29,33.46) R28.2 ; C91.1 115.04,30.37 v2(114.43,30.37) ; v2(109.28,31.05) R26.2 ; R19.2 v2(109.29,38.28) ; v2(109.27,29.83) R29.2 ; v2(114.45,34.5) C72.1 ; v2(114.42,39.99) C40.1 ; v2(109.28,26.22) 108.76,26.22 ; 108.76,39.47 v2(109.28,39.47) ; v2(114.45,33.38) C75.1
  Top Layer w0.75: C221.1 107.06,17.48 v1(106.35,17.48) ; C220.1 108.77,15.63 v1(108.08,15.63)
  vias: v1(106.43,15.38) v1(108.46,13.86)
0V675_EN: length 6.1
  Top Layer w0.254: v2(109.09,8.78) 109.08,8.77 R125.2 R124.1 ; v2(111.51,9.92) 111.44,9.99 U68.2
  Bottom Layer w0.254: v2(111.51,9.92) 111.51,9.28 111,8.78 v2(109.09,8.78)
0V675_REF: length 159.4
  Top Layer w0.099: v2(112.65,9.03) 112.65,10.47 U68.4
  Top Layer w0.15: U2.H7 86.27,64.91 90.22,64.91 v2(90.65,64.49)
  Top Layer w0.305: C222.1 113.82,9.47 U68.4
  Top Layer w0.75: v1(116.84,9.92) 116.39,9.47 C222.1
  SIGNAL4 w0.099: v2(81.87,34.22) 81.53,34.56 80.73,34.56 v2(79.47,35.81) 79.07,36.21 76.97,36.21 76.27,36.91 v2(76.27,37.42) ; v2(94.54,37.2) 93.67,36.34 v2(90.93,36.34)
  Bottom Layer w0.099: v2(81.87,34.22) 82.19,34.22 82.78,34.81 84.84,34.81 85.43,35.41 85.5,35.41 85.69,35.6 85.69,35.66 87.38,37.35 89.79,37.35 90.81,36.34 v2(90.93,36.34) ; v2(94.54,37.2) 94.9,36.84 96.58,36.84 C35.2 ; v2(112.65,9.03) 111.25,7.63 106.93,7.63 106.17,8.4 106.17,13.6 105.03,14.75 105.03,32.53 103.76,33.8 101.6,33.8 101.43,33.62 98.98,33.62 98.74,33.86 97.79,33.86 98.36,34.43 99.57,34.43 100,34 v2(100.14,34)
  Bottom Layer w0.15: C38.1 91.4,58.28 91.4,58.71 91.69,59.01 91.69,60.22 91.81,60.33 91.81,63.84 91.16,64.49 90.86,64.49
  Bottom Layer w0.254: C39.1 94.23,57.1 94.23,54.24 98.17,50.31 110.24,50.31 119.13,41.42 119.13,12.21 v1(116.84,9.92)
  Bottom Layer w0.5: C36.1 v2(79.47,35.81) ; 97.79,33.86 C35.2
  Bottom Layer w0.75: C38.1 C39.1
